# Altium project bmplc.prjpcb
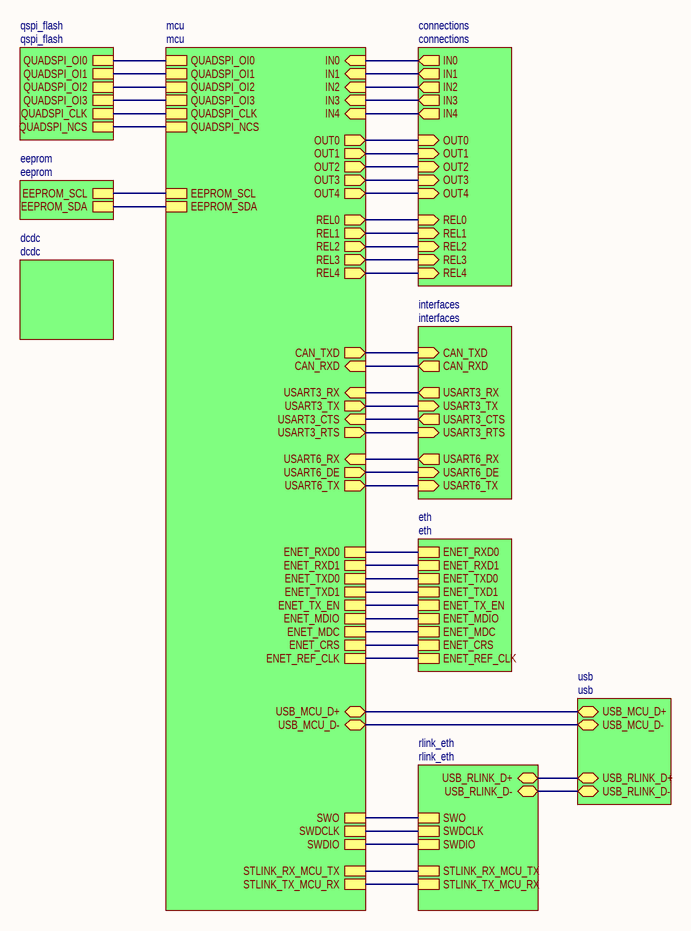
[diagram p0: main.SchDoc]
10 sheets, 194 parts. Net scope: hierarchical (ports join the sheet entries above them; power ports are global).
Board file: pcb.pcbdoc
Sheets:
  main.SchDoc
    mcu = mcu.SchDoc
    connections = connections.schdoc
    interfaces = interfaces.schdoc
    dcdc = dcdc.schdoc
    qspi_flash = qspi_flash.schdoc
    eeprom = eeprom.SchDoc
    eth = eth.SchDoc
    usb = usb.SchDoc
    rlink_eth = rlink_eth.schdoc

## Sheet main.SchDoc
size 209 x 297 mm

### Sub-sheets
connections = connections: IN0 (out), IN1 (out), IN2 (out), IN3 (out), IN4 (out), OUT0 (in), OUT1 (in), OUT2 (in), OUT3 (in), OUT4 (in), REL0 (in), REL1 (in), REL2 (in), REL3 (in), REL4 (in)
dcdc = dcdc: no entries
eeprom = eeprom: EEPROM_SCL, EEPROM_SDA
eth = eth: ENET_RXD0, ENET_RXD1, ENET_TXD0, ENET_TXD1, ENET_TX_EN, ENET_MDIO, ENET_MDC, ENET_CRS, ENET_REF_CLK
interfaces = interfaces: CAN_TXD (in), CAN_RXD (out), USART3_RX (out), USART3_TX (in), USART3_CTS (out), USART3_RTS (in), USART6_RX (out), USART6_DE (in), USART6_TX (in)
mcu = mcu: IN0 (in), IN1 (in), IN2 (in), IN3 (in), IN4 (in), OUT0 (out), OUT1 (out), OUT2 (out), OUT3 (out), OUT4 (out), REL0 (out), REL1 (out), REL2 (out), REL3 (out), REL4 (out), CAN_TXD (out), CAN_RXD (in), USART3_RX (in), USART3_TX (out), USART3_CTS (in), USART3_RTS (out), USART6_RX (in), USART6_DE (out), USART6_TX (out), QUADSPI_OI0, QUADSPI_OI1, QUADSPI_OI2, QUADSPI_OI3, QUADSPI_CLK, QUADSPI_NCS, EEPROM_SCL, EEPROM_SDA, ENET_RXD0, ENET_RXD1, ENET_TXD0, ENET_TXD1, ENET_TX_EN, ENET_MDIO, ENET_MDC, ENET_CRS, USB_MCU_D+ (bidir), ENET_REF_CLK, SWO, SWDCLK, SWDIO, STLINK_RX_MCU_TX, STLINK_TX_MCU_RX, USB_MCU_D- (bidir)
qspi_flash = qspi_flash: QUADSPI_OI0, QUADSPI_OI1, QUADSPI_OI2, QUADSPI_OI3, QUADSPI_CLK, QUADSPI_NCS
rlink_eth = rlink_eth: USB_RLINK_D+ (bidir), USB_RLINK_D- (bidir), SWO, SWDCLK, SWDIO, STLINK_RX_MCU_TX, STLINK_TX_MCU_RX
usb = usb: USB_MCU_D+ (bidir), USB_MCU_D- (bidir), USB_RLINK_D+ (bidir), USB_RLINK_D- (bidir)

### Nets
ENET_CRS: sheet mcu/ENET_CRS, sheet eth/ENET_CRS
ENET_MDC: sheet mcu/ENET_MDC, sheet eth/ENET_MDC
ENET_MDIO: sheet mcu/ENET_MDIO, sheet eth/ENET_MDIO
ENET_REF_CLK: sheet mcu/ENET_REF_CLK, sheet eth/ENET_REF_CLK
ENET_RXD0: sheet mcu/ENET_RXD0, sheet eth/ENET_RXD0
ENET_RXD1: sheet mcu/ENET_RXD1, sheet eth/ENET_RXD1
ENET_TX_EN: sheet mcu/ENET_TX_EN, sheet eth/ENET_TX_EN
ENET_TXD0: sheet mcu/ENET_TXD0, sheet eth/ENET_TXD0
ENET_TXD1: sheet mcu/ENET_TXD1, sheet eth/ENET_TXD1
QUADSPI_CLK: sheet mcu/QUADSPI_CLK, sheet qspi_flash/QUADSPI_CLK
QUADSPI_NCS: sheet mcu/QUADSPI_NCS, sheet qspi_flash/QUADSPI_NCS
QUADSPI_OI0: sheet mcu/QUADSPI_OI0, sheet qspi_flash/QUADSPI_OI0
QUADSPI_OI1: sheet mcu/QUADSPI_OI1, sheet qspi_flash/QUADSPI_OI1
QUADSPI_OI2: sheet mcu/QUADSPI_OI2, sheet qspi_flash/QUADSPI_OI2
QUADSPI_OI3: sheet mcu/QUADSPI_OI3, sheet qspi_flash/QUADSPI_OI3
SWCLK1: sheet mcu/SWDCLK, sheet rlink_eth/SWDCLK
SWDIO1: sheet mcu/SWDIO, sheet rlink_eth/SWDIO
SWO1: sheet mcu/SWO, sheet rlink_eth/SWO
USB_MCU_N: sheet mcu/USB_MCU_D-, sheet usb/USB_MCU_D-
USB_MCU_P: sheet mcu/USB_MCU_D+, sheet usb/USB_MCU_D+
USB_RLINK_N: sheet usb/USB_RLINK_D-, sheet rlink_eth/USB_RLINK_D-
USB_RLINK_P: sheet usb/USB_RLINK_D+, sheet rlink_eth/USB_RLINK_D+
NetR18_2: sheet mcu/REL0, sheet connections/REL0
NetR19_2: sheet mcu/REL1, sheet connections/REL1
NetR20_2: sheet mcu/OUT0, sheet connections/OUT0
NetR21_2: sheet mcu/REL2, sheet connections/REL2
NetR22_2: sheet mcu/OUT1, sheet connections/OUT1
NetR23_2: sheet mcu/REL3, sheet connections/REL3
NetR24_2: sheet mcu/OUT2, sheet connections/OUT2
NetR25_2: sheet mcu/OUT3, sheet connections/OUT3
NetR26_2: sheet mcu/REL4, sheet connections/REL4
NetR27_2: sheet mcu/OUT4, sheet connections/OUT4
NetR73_2: sheet mcu/STLINK_RX_MCU_TX, sheet rlink_eth/STLINK_RX_MCU_TX
NetR74_2: sheet mcu/STLINK_TX_MCU_RX, sheet rlink_eth/STLINK_TX_MCU_RX
NetR76_1: sheet mcu/EEPROM_SDA, sheet eeprom/EEPROM_SDA
NetR77_1: sheet mcu/EEPROM_SCL, sheet eeprom/EEPROM_SCL
NetU1_46: sheet mcu/IN3, sheet connections/IN3
NetU1_47: sheet mcu/IN2, sheet connections/IN2
NetU1_48: sheet mcu/IN1, sheet connections/IN1
NetU1_55: sheet mcu/IN0, sheet connections/IN0
NetU1_77: sheet mcu/USART3_TX, sheet interfaces/USART3_TX
NetU1_78: sheet mcu/USART3_RX, sheet interfaces/USART3_RX
NetU1_80: sheet mcu/USART3_CTS, sheet interfaces/USART3_CTS
NetU1_81: sheet mcu/USART3_RTS, sheet interfaces/USART3_RTS
NetU1_93: sheet mcu/USART6_DE, sheet interfaces/USART6_DE
NetU1_96: sheet mcu/USART6_TX, sheet interfaces/USART6_TX
NetU1_97: sheet mcu/USART6_RX, sheet interfaces/USART6_RX
NetU1_114: sheet mcu/CAN_RXD, sheet interfaces/CAN_RXD
NetU1_115: sheet mcu/CAN_TXD, sheet interfaces/CAN_TXD
NetU1_127: sheet mcu/IN4, sheet connections/IN4

## Sheet mcu.SchDoc
size 209 x 297 mm; Scale: 1:1; DocumentType: Ñõåìà ýëåêòðè÷åñêàÿ ïðèíöèïèàëüíàÿ; FirstReferrence: ÀÁÂÃ.123456.001; Title1str: {Наименование}; PageSetup: Record=PageOptions¦CenterHorizontal=False¦CenterVertical=False¦PrintScale=0.95¦XCorrection=0.00¦YCorrection=0.00¦PrintKind=1¦BorderSize=5000000¦LeftOffset=0¦BottomOffset=0¦Orientation=1¦PaperLength=1000¦PaperWidth=1000¦Scale=100¦PaperSource=15¦PrintQuality=600¦MediaType=1¦DitherType=10¦PaperKind=A4¦PrintScaleMode=1; DocumentType1str: {Документ}; DocumentType2str: {Документ}
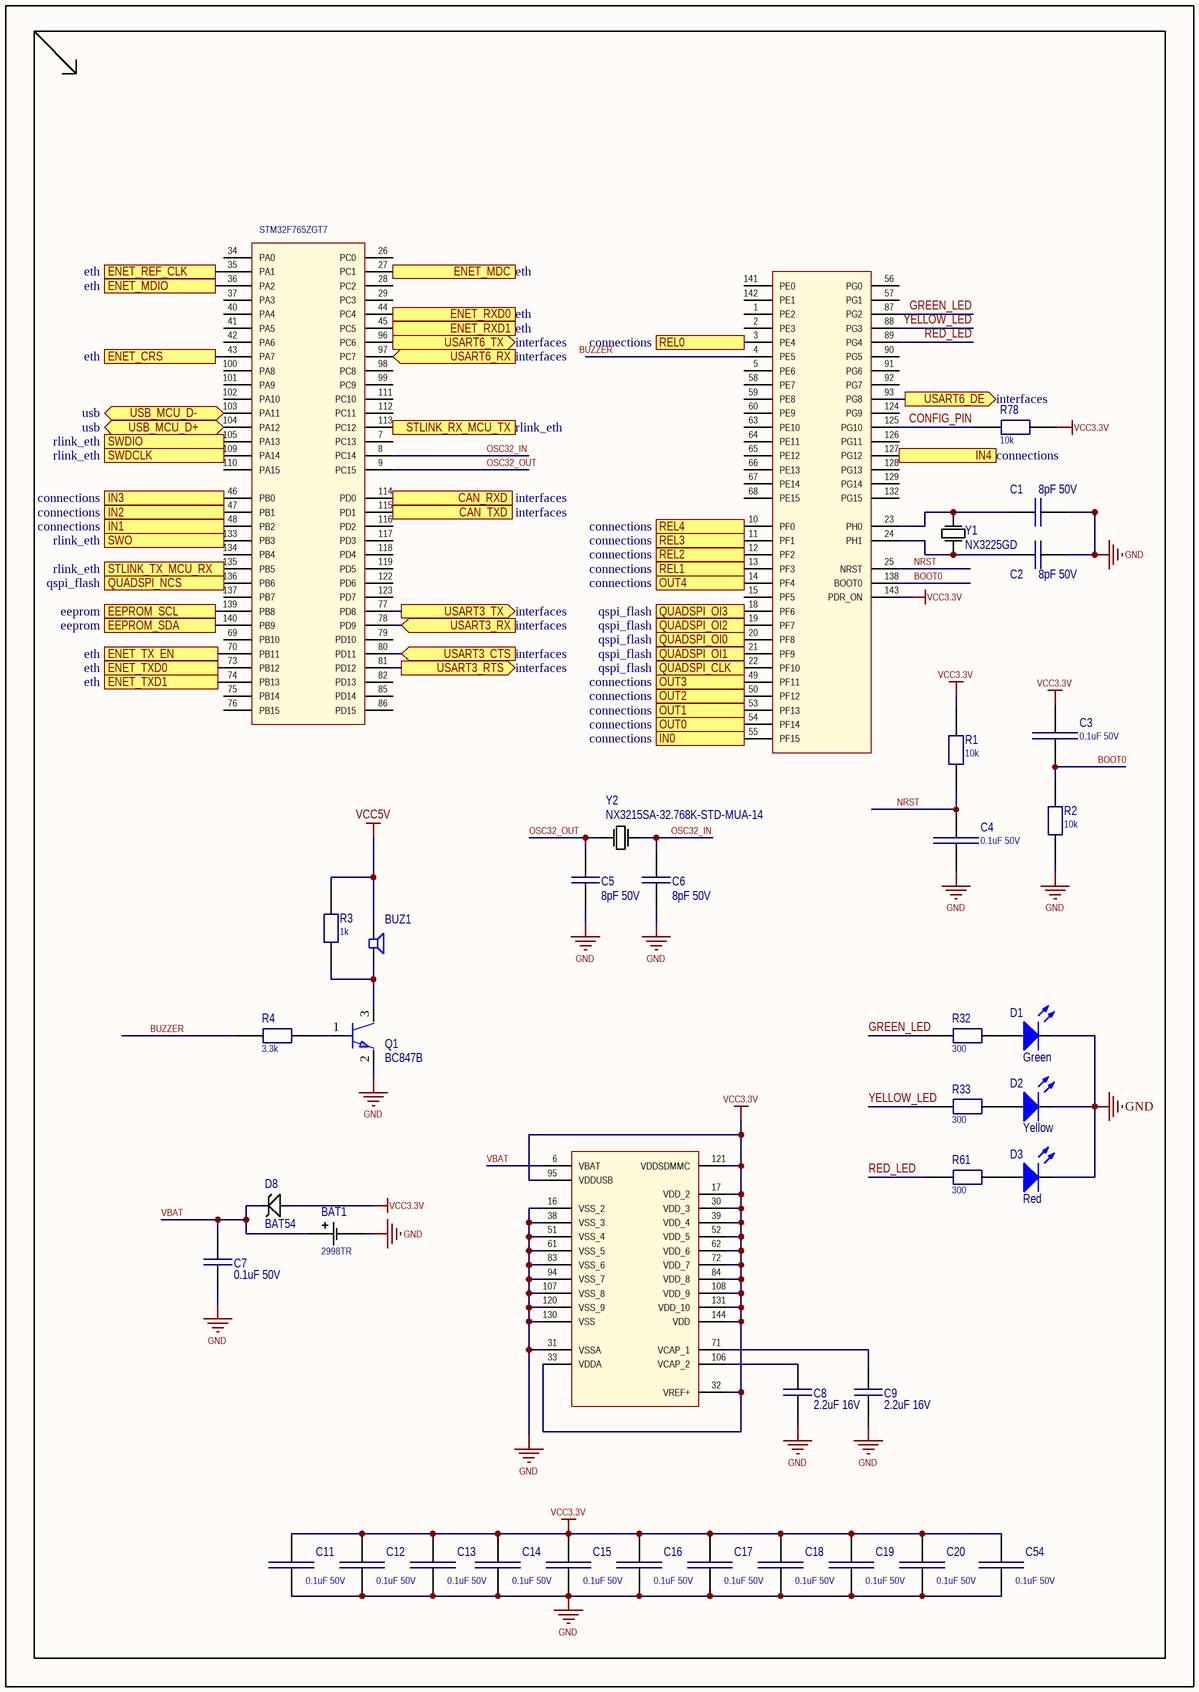
[diagram p1: mcu.SchDoc]

### Parts
BAT1  2998TR  [BAT_2998TR]
BUZ1  (no value)  [SPKR_PKMCS0909E4000-R1]
C1  8pF 50V  [C_0603]
C2  8pF 50V  [C_0603]
C3  0.1uF 50V  [C_0603]
C4  0.1uF 50V  [C_0603]
C5  8pF 50V  [C_0603]
C6  8pF 50V  [C_0603]
C7  0.1uF 50V  [C_0603]
C8  2.2uF 16V  [C_0603]
C9  2.2uF 16V  [C_0603]
C11  0.1uF 50V  [C_0603]
C12  0.1uF 50V  [C_0603]
C13  0.1uF 50V  [C_0603]
C14  0.1uF 50V  [C_0603]
C15  0.1uF 50V  [C_0603]
C16  0.1uF 50V  [C_0603]
C17  0.1uF 50V  [C_0603]
C18  0.1uF 50V  [C_0603]
C19  0.1uF 50V  [C_0603]
C20  0.1uF 50V  [C_0603]
C54  0.1uF 50V  [C_0603]
D1  Green  [LED_0603]
D2  Yellow  [LED_0603]
D3  Red  [LED_0603]
D8  BAT54  [SOT23]
Q1  BC847B  [SOT23]
R1  10k  [R_0603]
R2  10k  [R_0603]
R3  1k  [R_0603]
R4  3.3k  [R_0603]
R32  300  [R_0603]
R33  300  [R_0603]
R61  300  [R_0603]
R78  10k  [R_0603]
U1  STM32F765ZGT7  [TQFP144_M]  (parts A,B,C of 3)
Y1  NX3225GD  [NX3225GD]
Y2  NX3215SA-32.768K-STD-MUA-14  [XTAL_NX3215SA-32.768K-STD-MUA-8]

### Ports
CAN_RXD (in, see interfaces), CAN_TXD (out, see interfaces), EEPROM_SCL (see eeprom), EEPROM_SDA (see eeprom), ENET_CRS (see eth), ENET_MDC (see eth), ENET_MDIO (see eth), ENET_REF_CLK (see eth), ENET_RXD0 (see eth), ENET_RXD1 (see eth), ENET_TX_EN (see eth), ENET_TXD0 (see eth), ENET_TXD1 (see eth), IN0 (in, see connections), IN1 (in, see connections), IN2 (in, see connections), IN3 (in, see connections), IN4 (in, see connections), OUT0 (out, see connections), OUT1 (out, see connections), OUT2 (out, see connections), OUT3 (out, see connections), OUT4 (out, see connections), QUADSPI_CLK (see qspi_flash), QUADSPI_NCS (see qspi_flash), QUADSPI_OI0 (see qspi_flash), QUADSPI_OI1 (see qspi_flash), QUADSPI_OI2 (see qspi_flash), QUADSPI_OI3 (see qspi_flash), REL0 (out, see connections), REL1 (out, see connections), REL2 (out, see connections), REL3 (out, see connections), REL4 (out, see connections), STLINK_RX_MCU_TX (see rlink_eth), STLINK_TX_MCU_RX (see rlink_eth), SWDCLK (see rlink_eth), SWDIO (see rlink_eth), SWO (see rlink_eth), USART3_CTS (in, see interfaces), USART3_RTS (out, see interfaces), USART3_RX (in, see interfaces), USART3_TX (out, see interfaces), USART6_DE (out, see interfaces), USART6_RX (in, see interfaces), USART6_TX (out, see interfaces), USB_MCU_D+ (bidir, see usb), USB_MCU_D- (bidir, see usb)

### Nets
GND: BAT1.N(-) C1.1 C2.1 C4.1 C5.1 C6.1 C7.1 C8.1 C9.1 C11.1 C12.1 C13.1 C14.1 C15.1 C16.1 C17.1 C18.1 C19.1 C20.1 C54.1 D1.2(K) D2.2(K) D3.2(K) Q1.2 R2.1 U1.16(VSS_2) U1.31(VSSA) U1.38(VSS_3) U1.51(VSS_4) U1.61(VSS_5) U1.83(VSS_6) U1.94(VSS_7) U1.107(VSS_8) U1.120(VSS_9) U1.130(VSS)
VCC3.3V: C3.1 C11.2 C12.2 C13.2 C14.2 C15.2 C16.2 C17.2 C18.2 C19.2 C20.2 C54.2 D8.1 R1.2 R78.2 U1.17(VDD_2) U1.30(VDD_3) U1.32(VREF+) U1.33(VDDA) U1.39(VDD_4) U1.52(VDD_5) U1.62(VDD_6) U1.72(VDD_7) U1.84(VDD_8) U1.95(VDDUSB) U1.108(VDD_9) U1.121(VDDSDMMC) U1.131(VDD_10) U1.143(PDR_ON) U1.144(VDD)
VCC5V: BUZ1.1 R3.2
BOOT0: C3.2 R2.2 U1.138(BOOT0)
BUZZER: R4.1 U1.4(PE5)
CONFIG_PIN: R78.1 U1.125(PG10)
ENET_CRS: U1.43(PA7) ; port ENET_CRS
ENET_MDC: U1.27(PC1) ; port ENET_MDC
ENET_MDIO: U1.36(PA2) ; port ENET_MDIO
ENET_REF_CLK: U1.35(PA1) ; port ENET_REF_CLK
ENET_RXD0: U1.44(PC4) ; port ENET_RXD0
ENET_RXD1: U1.45(PC5) ; port ENET_RXD1
ENET_TX_EN: U1.70(PB11) ; port ENET_TX_EN
ENET_TXD0: U1.73(PB12) ; port ENET_TXD0
ENET_TXD1: U1.74(PB13) ; port ENET_TXD1
GREEN_LED: R32.2 U1.87(PG2)
NRST: C4.2 R1.1 U1.25(NRST)
OSC32_IN: C6.2 U1.8(PC14) Y2.2(OSC2)
OSC32_OUT: C5.2 U1.9(PC15) Y2.1(OSC1)
QUADSPI_CLK: U1.22(PF10) ; port QUADSPI_CLK
QUADSPI_NCS: U1.136(PB6) ; port QUADSPI_NCS
QUADSPI_OI0: U1.20(PF8) ; port QUADSPI_OI0
QUADSPI_OI1: U1.21(PF9) ; port QUADSPI_OI1
QUADSPI_OI2: U1.19(PF7) ; port QUADSPI_OI2
QUADSPI_OI3: U1.18(PF6) ; port QUADSPI_OI3
RED_LED: R61.2 U1.89(PG4)
SWCLK1: U1.109(PA14) ; port SWDCLK
SWDIO1: U1.105(PA13) ; port SWDIO
SWO1: U1.133(PB3) ; port SWO
USB_MCU_N: U1.103(PA11) ; port USB_MCU_D-
USB_MCU_P: U1.104(PA12) ; port USB_MCU_D+
VBAT: BAT1.P1(+) C7.2 D8.3 U1.6(VBAT)
YELLOW_LED: R33.2 U1.88(PG3)
NetBUZ1_2: BUZ1.2 Q1.3 R3.1
NetC1_2: C1.2 U1.23(PH0) Y1.2(OSC2)
NetC2_2: C2.2 U1.24(PH1) Y1.1(OSC1)
NetC8_2: C8.2 U1.106(VCAP_2)
NetC9_2: C9.2 U1.71(VCAP_1)
NetD1_1: D1.1(A) R32.1
NetD2_1: D2.1(A) R33.1
NetD3_1: D3.1(A) R61.1
NetQ1_1: Q1.1 R4.2
NetR18_2: U1.3(PE4) ; port REL0
NetR19_2: U1.13(PF3) ; port REL1
NetR20_2: U1.54(PF14) ; port OUT0
NetR21_2: U1.12(PF2) ; port REL2
NetR22_2: U1.53(PF13) ; port OUT1
NetR23_2: U1.11(PF1) ; port REL3
NetR24_2: U1.50(PF12) ; port OUT2
NetR25_2: U1.49(PF11) ; port OUT3
NetR26_2: U1.10(PF0) ; port REL4
NetR27_2: U1.14(PF4) ; port OUT4
NetR73_2: U1.113(PC12) ; port STLINK_RX_MCU_TX
NetR74_2: U1.135(PB5) ; port STLINK_TX_MCU_RX
NetR76_1: U1.140(PB9) ; port EEPROM_SDA
NetR77_1: U1.139(PB8) ; port EEPROM_SCL
NetU1_46: U1.46(PB0) ; port IN3
NetU1_47: U1.47(PB1) ; port IN2
NetU1_48: U1.48(PB2) ; port IN1
NetU1_55: U1.55(PF15) ; port IN0
NetU1_77: U1.77(PD8) ; port USART3_TX
NetU1_78: U1.78(PD9) ; port USART3_RX
NetU1_80: U1.80(PD11) ; port USART3_CTS
NetU1_81: U1.81(PD12) ; port USART3_RTS
NetU1_93: U1.93(PG8) ; port USART6_DE
NetU1_96: U1.96(PC6) ; port USART6_TX
NetU1_97: U1.97(PC7) ; port USART6_RX
NetU1_114: U1.114(PD0) ; port CAN_RXD
NetU1_115: U1.115(PD1) ; port CAN_TXD
NetU1_127: U1.127(PG12) ; port IN4

Not connected (* = marked no-connect by the designer): U1 1(PE2) 2(PE3) 5(PE6) 7(PC13) 15(PF5) 26(PC0) 28(PC2) 29(PC3) 34(PA0) 37(PA3) 40(PA4) 41(PA5) 42(PA6) 56(PG0) 57(PG1) 58(PE7) 59(PE8) 60(PE9) 63(PE10) 64(PE11) 65(PE12) 66(PE13) 67(PE14) 68(PE15) 69(PB10) 75(PB14) 76(PB15) 79(PD10) 82(PD13) 85(PD14) 86(PD15) 90(PG5) 91(PG6) 92(PG7) 98(PC8) 99(PC9) 100(PA8) 101(PA9) 102(PA10) 110(PA15) 111(PC10) 112(PC11) 116(PD2) 117(PD3) 118(PD4) 119(PD5) 122(PD6) 123(PD7) 124(PG9) 126(PG11) 128(PG13) 129(PG14) 132(PG15) 134(PB4) 137(PB7) 141(PE0) 142(PE1)

### Library data of the parts
BAT1 = 2998TR: Battery; Part: 2998TR; JLCPCB Part: C6078169
BUZ1 = BUZZER: Piezoelectric Sounders; Part: L-KLS3-SMT-09X1.8; Alternative Part: PKMCS0909E4000-R1; JLCPCB Part: C910763
C1 C2 C5 C6 = CAP_SMD: Capacitor; Part: CC0603DRNPO9BN8R0; Alternative Part: *; Value: 8pF 50V; JLCPCB Part: C326970
C3 C4 C11-C20 C54 = C0603: Capacitor; Part: CC0603KPX7R9BB104; Value: 0.1uF 50V; JLCPCB Part: C14663
C7 = CAP_SMD: Capacitor; Part: CC0603KPX7R9BB104; Alternative Part: *; Value: 0.1uF 50V; JLCPCB Part: C14663
C8 C9 = CAP_SMD: Capacitor; Part: CC0603KRX5R7BB225; Alternative Part: *; Value: 2.2uF 16V; JLCPCB Part: C106853
D1-D3 = LED_SMT_0603: LED; Part: FYLS-0603PGC; Alternative Part: KP-1608CGCK; Value: *
  D1: Color: Green; JLCPCB Part: C2994781
  D2: Color: Yellow; JLCPCB Part: C72038
  D3: Color: Red; JLCPCB Part: C2986060
D8 = BAT54: Diode; Part: BAT54; JLCPCB Part: C408389
Q1 = BC847B: Transistor; Part: BC847B; JLCPCB Part: C181140
R1 R2 R78 = RES_SMD: Resistor; Part: RC0603JR-0710KL; Alternative Part: *; Value: 10k; JLCPCB Part: C99198
R3 = RES_SMD: Resistor; Part: RC0603FR-071KL; Alternative Part: *; Value: 1k; JLCPCB Part: C22548
R4 = RES_SMD: Resistor; Part: RC0603FR-073K3L; Alternative Part: *; Value: 3.3k; JLCPCB Part: C108078
R32 R33 R61 = R0603: Resistor; Part: RC0603FR-07300RL; Value: 300; JLCPCB Part: C114617
U1 = STM32F76XZXT: Microcontroller; C: Copyright (C) 2016 Accelerated Designs. All rights reserved; Vendor: STMicroelectronics; Value: STM32F765ZGT7; Manufacturer_Part_Number: STM32F76XZXT; Copyright: Copyright (C) 2016 Accelerated Designs. All rights reserved; Part: STM32F765ZGT; JLCPCB Part: C1337348
Y1 = NX3225GD: Crystal Oscillator; Part: NX3225GD-8MHZ-STD-CRA-3; Alternative Part: *; JLCPCB Part: C889706
Y2 = NX3215SA-32.768K: Crystal Oscillator; Part: NX3215SA-32.768K-STD-MUA-14; Alternative Part: *; JLCPCB Part: C156244

## Sheet connections.schdoc
size 209 x 297 mm; Scale: 1:1; DocumentType: Схема электрическая принципиальная; FirstReferrence: АБВГ.123456.001; PageSetup: Record=PageOptions|CenterHorizontal=False|CenterVertical=False|PrintScale=0.95|XCorrection=0.00|YCorrection=0.00|PrintKind=1|BorderSize=5000000|LeftOffset=0|BottomOffset=0|Orientation=1|PaperLength=1000|PaperWidth=1000|Scale=100|PaperSource=15|PrintQuality=600|MediaType=1|DitherType=10|PaperKind=A4|PrintScaleMode=1
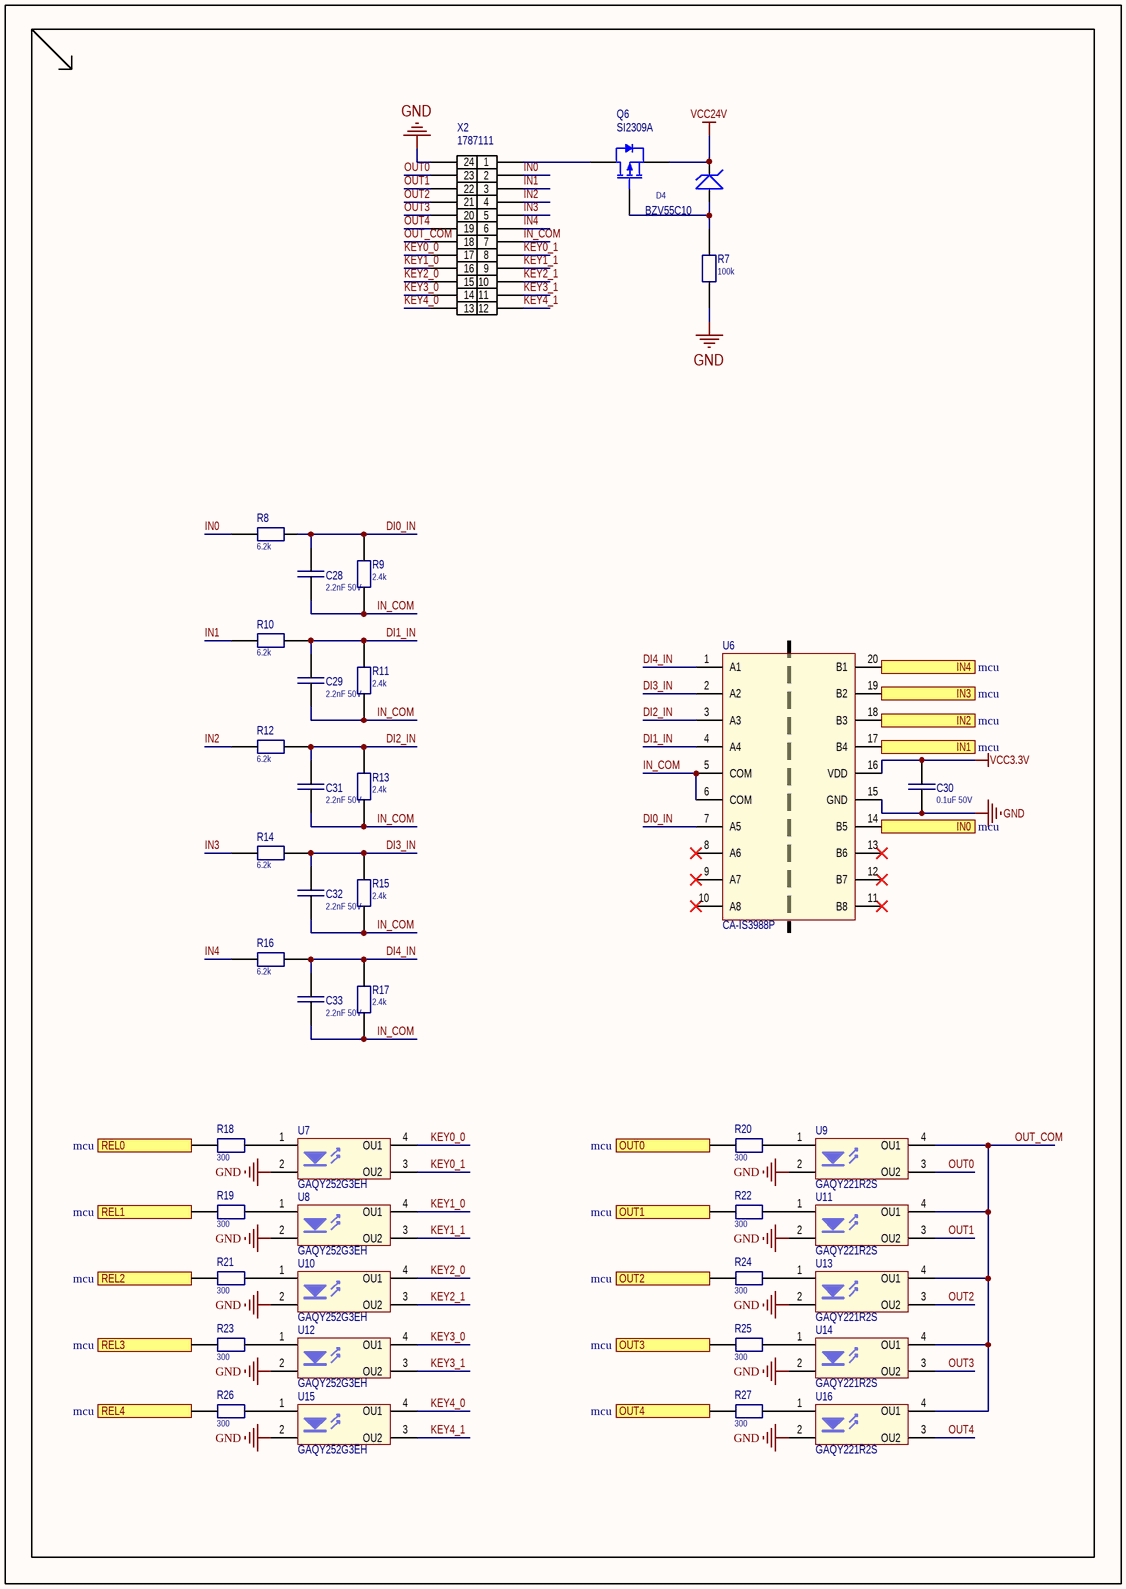
[diagram p2: connections.schdoc]

### Parts
C28  2.2nF 50V  [C_0805]
C29  2.2nF 50V  [C_0805]
C30  0.1uF 50V  [C_0603]
C31  2.2nF 50V  [C_0805]
C32  2.2nF 50V  [C_0805]
C33  2.2nF 50V  [C_0805]
D4  BZV55C10  [SOD80C]
Q6  SI2309A  [SOT23]
R7  100k  [R_0603]
R8  6.2k  [R_0805]
R9  2.4k  [R_0805]
R10  6.2k  [R_0805]
R11  2.4k  [R_0805]
R12  6.2k  [R_0805]
R13  2.4k  [R_0805]
R14  6.2k  [R_0805]
R15  2.4k  [R_0805]
R16  6.2k  [R_0805]
R17  2.4k  [R_0805]
R18  300  [R_0603]
R19  300  [R_0603]
R20  300  [R_0603]
R21  300  [R_0603]
R22  300  [R_0603]
R23  300  [R_0603]
R24  300  [R_0603]
R25  300  [R_0603]
R26  300  [R_0603]
R27  300  [R_0603]
U6  CA-IS3988P  [SOP64P600X175-20N]
U7  GAQY252G3EH  [SMD-4P]
U8  GAQY252G3EH  [SMD-4P]
U9  GAQY221R2S  [SOP254P700X270-4N]
U10  GAQY252G3EH  [SMD-4P]
U11  GAQY221R2S  [SOP254P700X270-4N]
U12  GAQY252G3EH  [SMD-4P]
U13  GAQY221R2S  [SOP254P700X270-4N]
U14  GAQY221R2S  [SOP254P700X270-4N]
U15  GAQY252G3EH  [SMD-4P]
U16  GAQY221R2S  [SOP254P700X270-4N]
X2  1787111  [DMC 1,5/12-G1F-3,5-LRP20THRR72]

### Ports
IN0 (out, see mcu), IN1 (out, see mcu), IN2 (out, see mcu), IN3 (out, see mcu), IN4 (out, see mcu), OUT0 (in, see mcu), OUT1 (in, see mcu), OUT2 (in, see mcu), OUT3 (in, see mcu), OUT4 (in, see mcu), REL0 (in, see mcu), REL1 (in, see mcu), REL2 (in, see mcu), REL3 (in, see mcu), REL4 (in, see mcu)

### Nets
GND: C30.1 R7.2 U6.15(GND) U7.2(K) U8.2(K) U9.2(K) U10.2(K) U11.2(K) U12.2(K) U13.2(K) U14.2(K) U15.2(K) U16.2(K) X2.24
VCC3.3V: C30.2 U6.16(VDD)
VCC24V: D4.2(K) Q6.2(S)
DI0_IN: C28.2 R8.2 R9.2 U6.7(A5)
DI1_IN: C29.2 R10.2 R11.2 U6.4(A4)
DI2_IN: C31.2 R12.2 R13.2 U6.3(A3)
DI3_IN: C32.2 R14.2 R15.2 U6.2(A2)
DI4_IN: C33.2 R16.2 R17.2 U6.1(A1)
IN0: R8.1 X2.2
IN1: R10.1 X2.3
IN2: R12.1 X2.4
IN3: R14.1 X2.5
IN4: R16.1 X2.6
IN_COM: C28.1 C29.1 C31.1 C32.1 C33.1 R9.1 R11.1 R13.1 R15.1 R17.1 U6.5(COM) U6.6(COM) X2.7
KEY0_0: U7.4(OU1) X2.17
KEY0_1: U7.3(OU2) X2.8
KEY1_0: U8.4(OU1) X2.16
KEY1_1: U8.3(OU2) X2.9
KEY2_0: U10.4(OU1) X2.15
KEY2_1: U10.3(OU2) X2.10
KEY3_0: U12.4(OU1) X2.14
KEY3_1: U12.3(OU2) X2.11
KEY4_0: U15.4(OU1) X2.13
KEY4_1: U15.3(OU2) X2.12
OUT0: U9.3(OU2) X2.23
OUT1: U11.3(OU2) X2.22
OUT2: U13.3(OU2) X2.21
OUT3: U14.3(OU2) X2.20
OUT4: U16.3(OU2) X2.19
OUT_COM: U9.4(OU1) U11.4(OU1) U13.4(OU1) U14.4(OU1) U16.4(OU1) X2.18
NetD4_1: D4.1(A) Q6.1(G) R7.1
NetQ6_3: Q6.3(D) X2.1
NetR18_1: R18.1 U7.1(A)
NetR18_2: R18.2 ; port REL0
NetR19_1: R19.1 U8.1(A)
NetR19_2: R19.2 ; port REL1
NetR20_1: R20.1 U9.1(A)
NetR20_2: R20.2 ; port OUT0
NetR21_1: R21.1 U10.1(A)
NetR21_2: R21.2 ; port REL2
NetR22_1: R22.1 U11.1(A)
NetR22_2: R22.2 ; port OUT1
NetR23_1: R23.1 U12.1(A)
NetR23_2: R23.2 ; port REL3
NetR24_1: R24.1 U13.1(A)
NetR24_2: R24.2 ; port OUT2
NetR25_1: R25.1 U14.1(A)
NetR25_2: R25.2 ; port OUT3
NetR26_1: R26.1 U15.1(A)
NetR26_2: R26.2 ; port REL4
NetR27_1: R27.1 U16.1(A)
NetR27_2: R27.2 ; port OUT4
NetU1_46: U6.19(B2) ; port IN3
NetU1_47: U6.18(B3) ; port IN2
NetU1_48: U6.17(B4) ; port IN1
NetU1_55: U6.14(B5) ; port IN0
NetU1_127: U6.20(B1) ; port IN4

Not connected (* = marked no-connect by the designer): U6 8(A6)* 9(A7)* 10(A8)* 11(B8)* 12(B7)* 13(B6)*

### Library data of the parts
C28 C29 C31-C33 = C0805: Capacitor; Part: CC0805KRX7R9BB222; Alternative Part: CL21B222KBANNNC; Value: 2.2nF 50V; JLCPCB Part: C107146
C30 = C0603: Capacitor; Part: CC0603KPX7R9BB104; Value: 0.1uF 50V; JLCPCB Part: C14663
D4 = DZ_SOD80: Diode; Part: BZV55C10; JLCPCB Part: C545361
Q6 = P-ch_SOT23: P-Channel MOSFET; Part: SI2309A; JLCPCB Part: C2681220
R7 = RES_SMD: Resistor; Part: RC0603JR-07100KL; Alternative Part: *; Value: 100k; JLCPCB Part: C100048
R8 R10 R12 R14 R16 = R0805: Resistor; Part: RC0805JR-076K2L; Alternative Part: CR-05JL7-6K2; Value: 6.2k; JLCPCB Part: C114535
R9 R11 R13 R15 R17 = R0805: Resistor; Part: RC0805JR-072K4L; Alternative Part: CR-05JL7-2K4; Value: 2.4k; JLCPCB Part: C114236
R18-R27 = R0603: Resistor; Part: RC0603FR-07300RL; Value: 300; JLCPCB Part: C114617
U6 = CA-IS3988P: Isolated Octal Industrial Digital Input; Part: CA-IS3988P; JLCPCB Part: C5210911
U7 U8 U10 U12 U15 = GAQY252G3EH: Solid State Relay 60V 3A; Part: GAQY252G3EH; JLCPCB Part: C7435131
U9 U11 U13 U14 U16 = KAQY212S: Solid State Relay 60V 250mA; Part: GAQY221R2S; JLCPCB Part: C22385176
X2 = DMC 1,5/12-G1F-3,5-LRP20THRR72 / 1706067: THR-3.5-24P; Part: 1787111; JLCPCB Part: 1787111

## Sheet interfaces.schdoc
size 209 x 297 mm; Scale: 1:1; DocumentType: Ñõåìà ýëåêòðè÷åñêàÿ ïðèíöèïèàëüíàÿ; FirstReferrence: ÀÁÂÃ.123456.001; PageSetup: Record=PageOptions¦CenterHorizontal=False¦CenterVertical=False¦PrintScale=0.95¦XCorrection=0.00¦YCorrection=0.00¦PrintKind=1¦BorderSize=5000000¦LeftOffset=0¦BottomOffset=0¦Orientation=1¦PaperLength=1000¦PaperWidth=1000¦Scale=100¦PaperSource=15¦PrintQuality=600¦MediaType=1¦DitherType=10¦PaperKind=A4¦PrintScaleMode=1
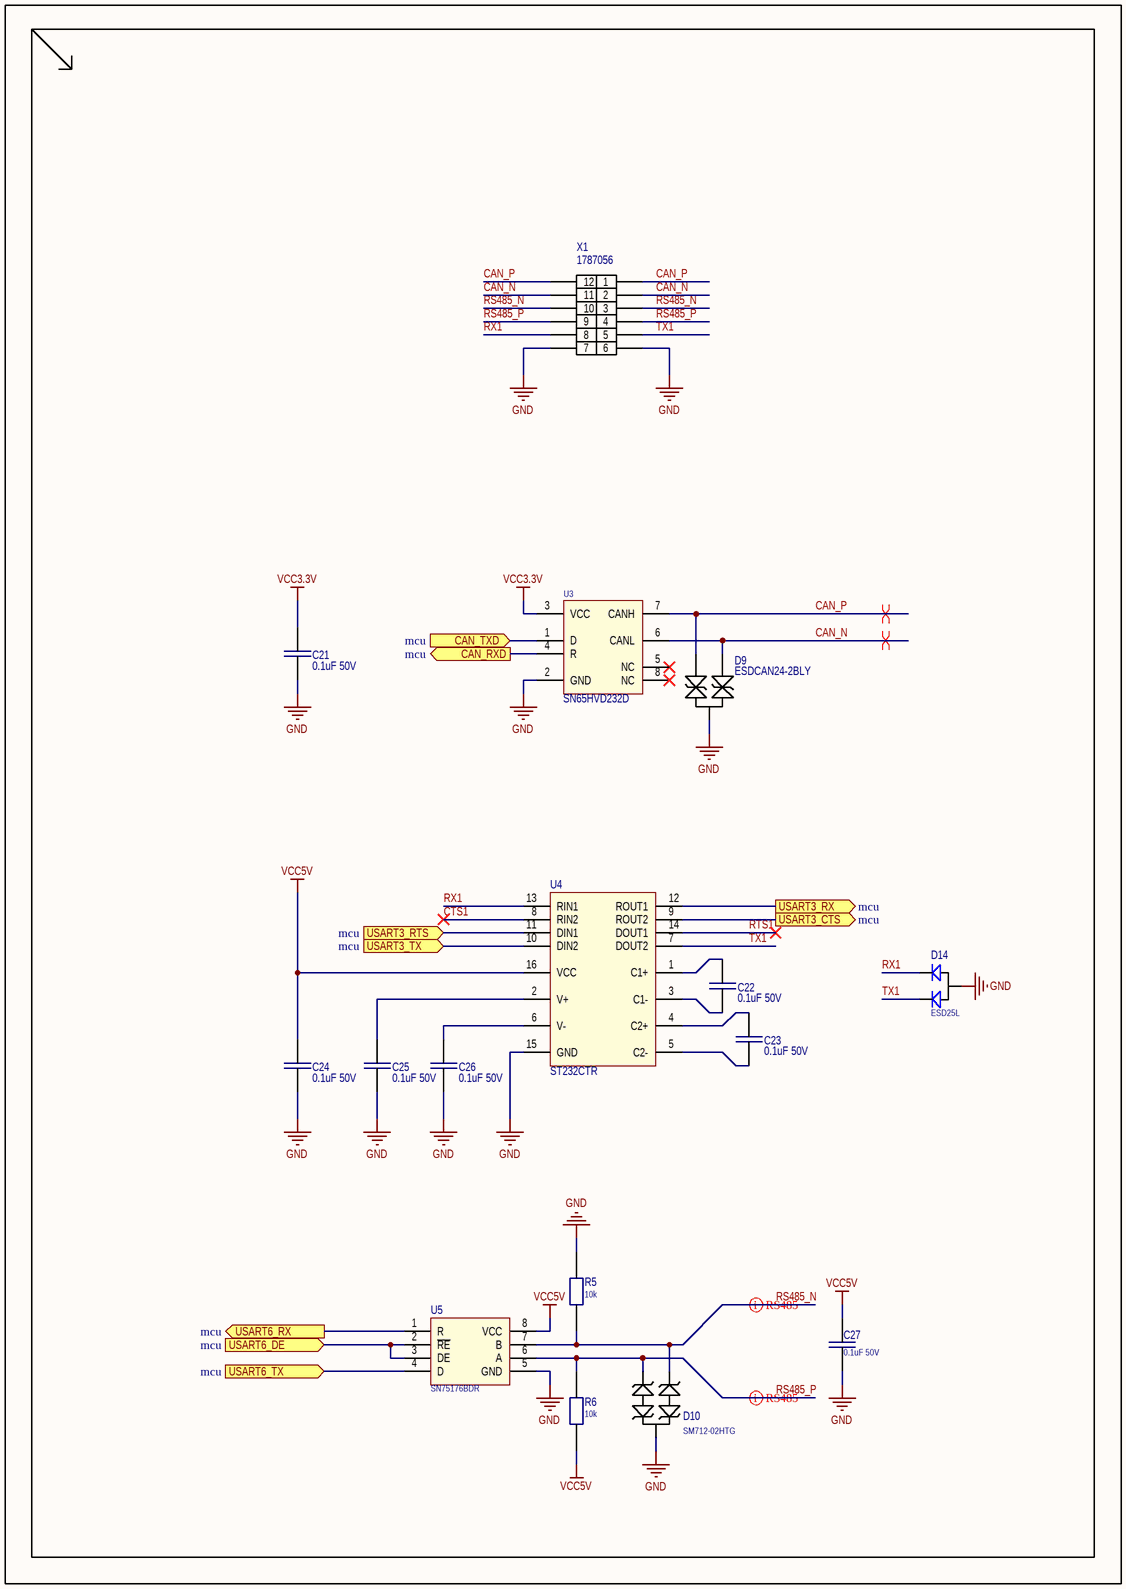
[diagram p3: interfaces.schdoc]

### Parts
C21  0.1uF 50V  [C_0603]
C22  0.1uF 50V  [C_0603]
C23  0.1uF 50V  [C_0603]
C24  0.1uF 50V  [C_0603]
C25  0.1uF 50V  [C_0603]
C26  0.1uF 50V  [C_0603]
C27  0.1uF 50V  [C_0603]
D9  ESDCAN24-2BLY  [SOT23]
D10  SM712-02HTG  [SOT23]
D14  ESD25L  [SOT23]
R5  10k  [R_0603]
R6  10k  [R_0603]
U3  SN65HVD232D  [SO-8_M]
U4  ST232CTR  [TSSOP16_STM]
U5  SN75176BDR  [SO-8]
X1  1787056  [DMC 1.5/ 6-G1F-3.5-LR P20THR 1787056]

### Ports
CAN_RXD (out, see mcu), CAN_TXD (in, see mcu), USART3_CTS (out, see mcu), USART3_RTS (in, see mcu), USART3_RX (out, see mcu), USART3_TX (in, see mcu), USART6_DE (in, see mcu), USART6_RX (out, see mcu), USART6_TX (in, see mcu)

### Nets
GND: C21.1 C24.1 C25.1 C26.1 C27.1 D9.3 D10.3 D14.3 R5.2 U3.2(GND) U4.15(GND) U5.5(GND) X1.6 X1.7
VCC3.3V: C21.2 U3.3(VCC)
VCC5V: C24.2 C27.2 R6.1 U4.16(VCC) U5.8(VCC)
CAN_N: D9.2 U3.6(CANL) X1.2 X1.11
CAN_P: D9.1 U3.7(CANH) X1.1 X1.12
CTS1: U4.8(RIN2)
RS485_N: D10.1 R5.1 U5.7(B) X1.3 X1.10
RS485_P: D10.2 R6.2 U5.6(A) X1.4 X1.9
RTS1: U4.14(DOUT1)
RX1: D14.2 U4.13(RIN1) X1.8
TX1: D14.1 U4.7(DOUT2) X1.5
NetC22_1: C22.1 U4.1(C1+)
NetC22_2: C22.2 U4.3(C1-)
NetC23_1: C23.1 U4.4(C2+)
NetC23_2: C23.2 U4.5(C2-)
NetC25_2: C25.2 U4.2(V+)
NetC26_2: C26.2 U4.6(V-)
NetU1_77: U4.10(DIN2) ; port USART3_TX
NetU1_78: U4.12(ROUT1) ; port USART3_RX
NetU1_80: U4.9(ROUT2) ; port USART3_CTS
NetU1_81: U4.11(DIN1) ; port USART3_RTS
NetU1_93: U5.2(~{RE}) U5.3(DE) ; port USART6_DE
NetU1_96: U5.4(D) ; port USART6_TX
NetU1_97: U5.1(R) ; port USART6_RX
NetU1_114: U3.4(R) ; port CAN_RXD
NetU1_115: U3.1(D) ; port CAN_TXD

Not connected (* = marked no-connect by the designer): U3 5(NC)* 8(NC)*

### Layout directives
differential pair; net class CAN: CAN_N, CAN_P
differential pair; net class RS485; differential pair class RS485: RS485_N, RS485_P

### Library data of the parts
C21 C27 = CAP_SMD: Capacitor; Part: CC0603KPX7R9BB104; Alternative Part: *; Value: 0.1uF 50V; JLCPCB Part: C14663
C22-C26 = C0603: Capacitor; Part: CC0603KPX7R9BB104; Value: 0.1uF 50V; JLCPCB Part: C14663
D9 = ESD_CAN: ESD; Value: ESDCAN24-2BLY; Part: ESDCAN24-2BLY; Alternative Part: *; JLCPCB Part: C5158050
D10 = ESD: Value: SM712-02HTG; Part: SM712-02HTG; Alternative Part: *; JLCPCB Part: C5449363
D14 = TVS_SOT23: Diode; Part: ESDA25L; JLCPCBPart: C95343; JLCPCB Part: C95343
R5 R6 = RES_SMD: Resistor; Part: RC0603JR-0710KL; Alternative Part: *; Value: 10k; JLCPCB Part: C99198
U3 = SN65HVD232D: CAN_transiever; Part: SN65HVD232DR; Alternative Part: *; JLCPCB Part: C30530
U4 = ST232CTR: Mfr_Name: STMicroelectronics; Copyright: Copyright (C) 2022 Ultra Librarian. All rights reserved.; Part: ST232CTR; RefDes: RefDes; Type: DEV; JLCPCB Part: C13482
U5 = SN75176BDR: RS485 Half Duplex Convertor; Part: SN75176BDR; JLCPCB Part: C2829048
X1 = 15EDGRHCM-THR-3.5: THR-3.5-12P; Part: 1787056; JLCPCB Part: C2923273

## Sheet dcdc.schdoc
size 209 x 297 mm; PageSetup: Record=PageOptions|CenterHorizontal=False|CenterVertical=False|PrintScale=0.95|XCorrection=0.00|YCorrection=0.00|PrintKind=1|BorderSize=5000000|LeftOffset=0|BottomOffset=0|Orientation=1|PaperLength=1000|PaperWidth=1000|Scale=100|PaperSource=15|PrintQuality=600|MediaType=1|DitherType=10|PaperKind=A4|PrintScaleMode=1
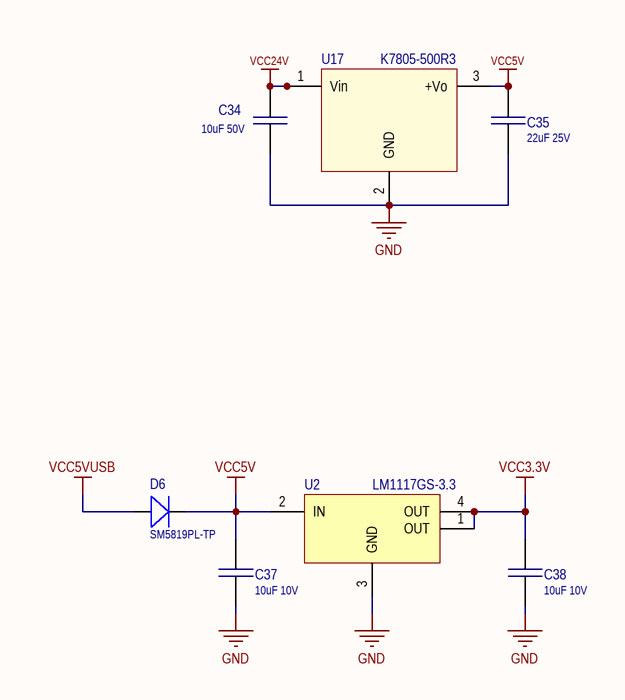
[diagram p4: dcdc.schdoc]

### Parts
C34  10uF 50V  [C_1206]
C35  22uF 25V  [C_1206]
C37  10uF 10V  [C_0805]
C38  10uF 10V  [C_0805]
D6  SM5819PL-TP  [SOD-123]
U2  LM1117GS-3.3  [SOT 223]
U17  K7805-500R3  [K7805500R3]

### Nets
GND: C34.2 C35.1 C37.1 C38.1 U2.3(GND) U17.2(GND)
VCC3.3V: C38.2 U2.1(OUT) U2.4(OUT)
VCC5V: C35.2 C37.2 D6.2(K) U2.2(IN) U17.3(+Vo)
VCC5VUSB: D6.1(A)
VCC24V: C34.1 U17.1(Vin)

### Library data of the parts
C34 = C1206: Capacitor; Part: CC1206KKX5R9BB106; Alternative Part: CL31A106KBHNNNE; Value: 10uF 50V; JLCPCB Part: C100122
C35 = C1206: Capacitor; Part: CC1206KKX5R8BB226; Alternative Part: CL31A226KAHNNNE; Value: 22uF 25V; JLCPCB Part: C2178233
C37 C38 = C0805: Capacitor; Part: CC0805KKX5R6BB106; Value: 10uF 10V; Parameter 2: *; JLCPCB Part: C89832
D6 = D_SOD123: Diode; Part: SM5819PL-TP; JLCPCB Part: C19992592
U2 = LDO 3.3v: Part: LM1117GS-3.3; JLCPCB Part: C411821
U17 = K78xx-500R3: Non-isolated dc-dc; Part: K7805-500R3; JLCPCB Part: C19188491

## Sheet qspi_flash.schdoc
size 209 x 297 mm; Scale: 1:1; DocumentType: Ñõåìà ýëåêòðè÷åñêàÿ ïðèíöèïèàëüíàÿ; FirstReferrence: ÀÁÂÃ.123456.001; Title1str: {Наименование}; PageSetup: Record=PageOptions¦CenterHorizontal=False¦CenterVertical=False¦PrintScale=0.95¦XCorrection=0.00¦YCorrection=0.00¦PrintKind=1¦BorderSize=5000000¦LeftOffset=0¦BottomOffset=0¦Orientation=1¦PaperLength=1000¦PaperWidth=1000¦Scale=100¦PaperSource=15¦PrintQuality=600¦MediaType=1¦DitherType=10¦PaperKind=A4¦PrintScaleMode=1; DocumentType1str: {Документ}; DocumentType2str: {Документ}
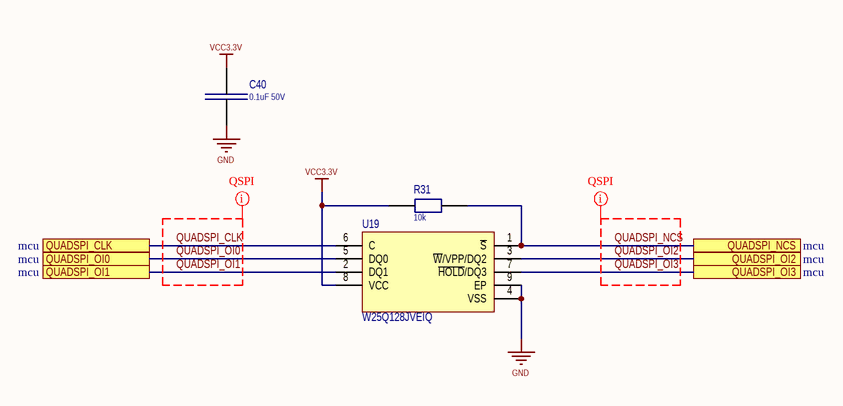
[diagram p5: qspi_flash.schdoc]

### Parts
C40  0.1uF 50V  [C_0603]
R31  10k  [R_0603]
U19  W25Q128JVEIQ  [W-PDFN-8 (MLP8) – 8mm ? 6mm  Se]

### Ports
QUADSPI_CLK (see mcu), QUADSPI_NCS (see mcu), QUADSPI_OI0 (see mcu), QUADSPI_OI1 (see mcu), QUADSPI_OI2 (see mcu), QUADSPI_OI3 (see mcu)

### Nets
GND: C40.1 U19.4(VSS) U19.9(EP)
VCC3.3V: C40.2 R31.1 U19.8(VCC)
QUADSPI_CLK: U19.6(C) ; port QUADSPI_CLK
QUADSPI_NCS: R31.2 U19.1(~{S}) ; port QUADSPI_NCS
QUADSPI_OI0: U19.5(DQ0) ; port QUADSPI_OI0
QUADSPI_OI1: U19.2(DQ1) ; port QUADSPI_OI1
QUADSPI_OI2: U19.3(~{W}/VPP/DQ2) ; port QUADSPI_OI2
QUADSPI_OI3: U19.7(~{HOLD}/DQ3) ; port QUADSPI_OI3

### Layout directives
net class QSPI: QUADSPI_CLK, QUADSPI_NCS, QUADSPI_OI0, QUADSPI_OI1, QUADSPI_OI2, QUADSPI_OI3

### Library data of the parts
C40 = C0603: Capacitor; Part: CC0603KPX7R9BB104; Value: 0.1uF 50V; JLCPCB Part: C14663
R31 = RES_SMD: Resistor; Part: RC0603JR-0710KL; Alternative Part: *; Value: 10k; JLCPCB Part: C99198
U19 = MT25QL********W9-0SIT: Flash Memory; Part: W25Q128JVEIQ; Alternative Part: *; JLCPCB Part: C2456297

## Sheet eeprom.SchDoc
size 209 x 297 mm
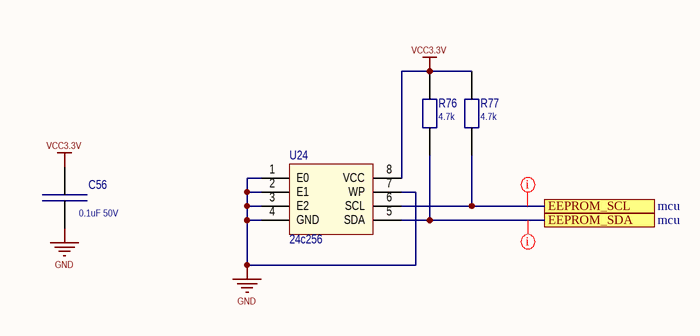
[diagram p6: eeprom.SchDoc]

### Parts
C56  0.1uF 50V  [C_0603]
R76  4.7k  [R_0603]
R77  4.7k  [R_0603]
U24  24c256  [SO-8_M]

### Ports
EEPROM_SCL (see mcu), EEPROM_SDA (see mcu)

### Nets
GND: C56.1 U24.1(E0) U24.2(E1) U24.3(E2) U24.4(GND) U24.7(WP)
VCC3.3V: C56.2 R76.2 R77.2 U24.8(VCC)
NetR76_1: R76.1 U24.5(SDA) ; port EEPROM_SDA
NetR77_1: R77.1 U24.6(SCL) ; port EEPROM_SCL

### Layout directives
net class I2C_EEPROM: NetR76_1, NetR77_1

### Library data of the parts
C56 = C0603: Capacitor; Part: CC0603KPX7R9BB104; Value: 0.1uF 50V; JLCPCB Part: C14663
R76 R77 = RES_SMD: Resistor; Part: RC0603FR-074K7L; Alternative Part: *; Value: 4.7k; JLCPCB Part: C99782
U24 = 24c256: 256-Kbit I2C-compatible Serial EEPROM; Part: AT24C256C; JLCPCB Part: C6482

## Sheet eth.SchDoc
size A4
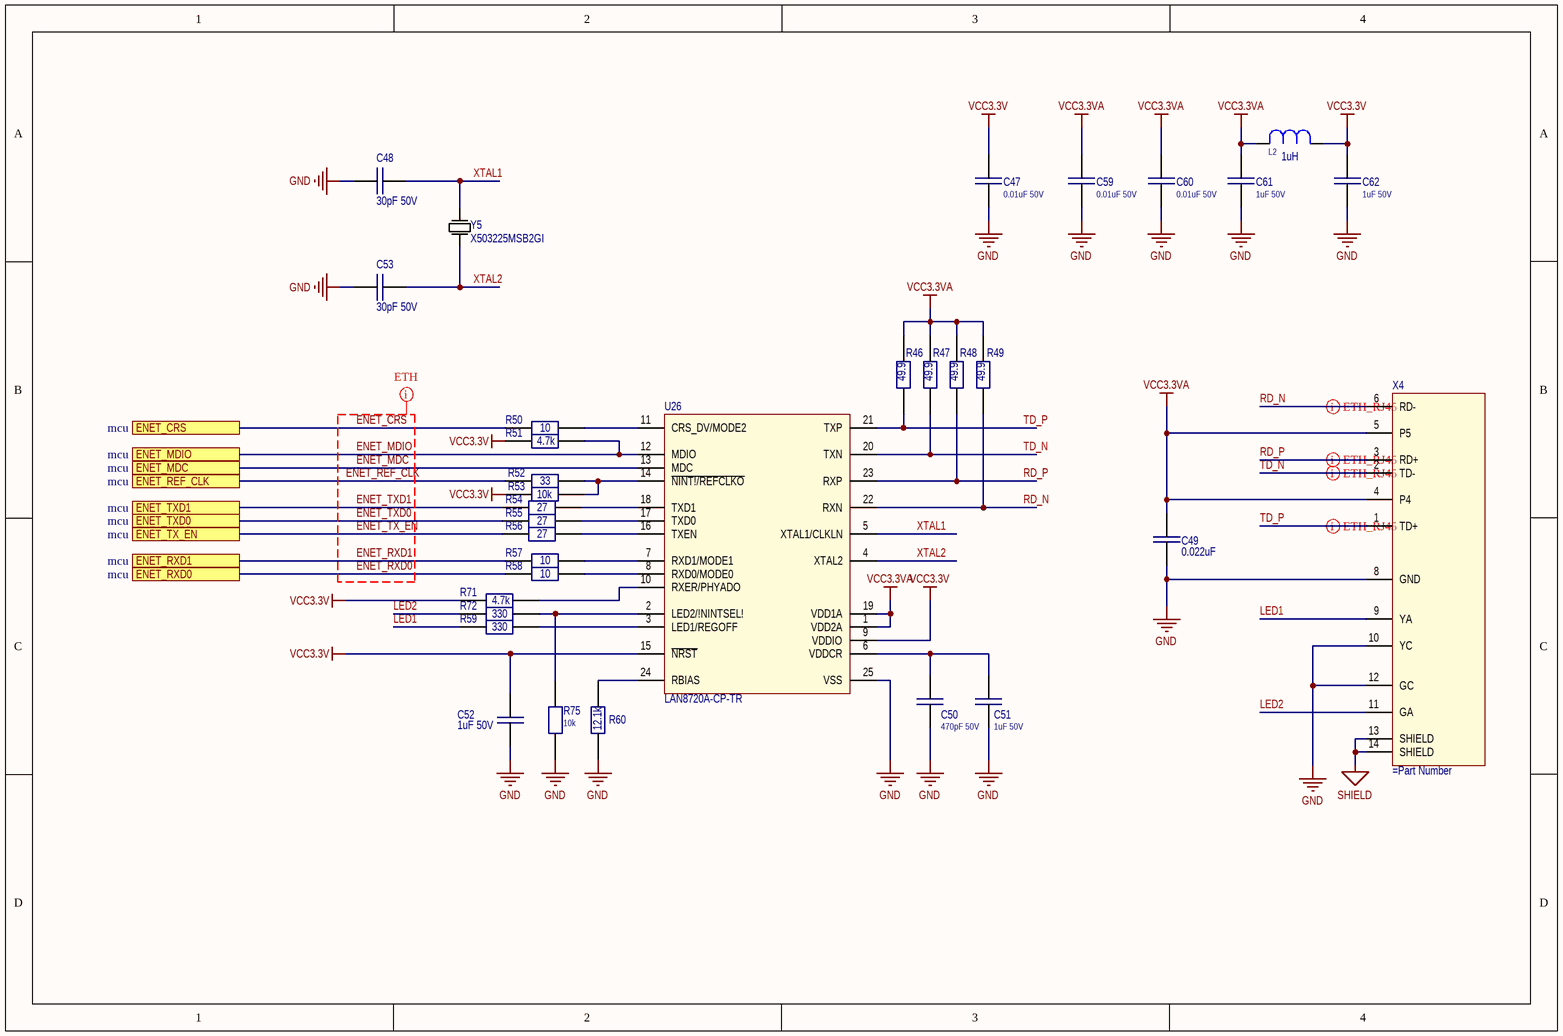
[diagram p7: eth.SchDoc]

### Parts
C47  0.01uF 50V  [C_0402]
C48  30pF 50V  [C_0603]
C49  0.022uF  [C_0603]
C50  470pF 50V  [C_0402]
C51  1uF 50V  [C_0603]
C52  1uF 50V  [C_0603]
C53  30pF 50V  [C_0603]
C59  0.01uF 50V  [C_0402]
C60  0.01uF 50V  [C_0402]
C61  1uF 50V  [C_0603]
C62  1uF 50V  [C_0603]
L2  1uH  [L_0603]
R46  49.9  [R_0603]
R47  49.9  [R_0603]
R48  49.9  [R_0603]
R49  49.9  [R_0603]
R50  10  [R_0603]
R51  4.7k  [R_0603]
R52  33  [R_0603]
R53  10k  [R_0603]
R54  27  [R_0603]
R55  27  [R_0603]
R56  27  [R_0603]
R57  10  [R_0603]
R58  10  [R_0603]
R59  330  [R_0603]
R60  12.1k  [R_0603]
R71  4.7k  [R_0603]
R72  330  [R_0603]
R75  10k  [R_0603]
U26  LAN8720A-CP-TR  [QFN50P400X400X100-25N]
X4  (no value)  [RJ45-TH_HR915340A]
Y5  X503225MSB2GI  [X5032]

### Ports
ENET_CRS (see mcu), ENET_MDC (see mcu), ENET_MDIO (see mcu), ENET_REF_CLK (see mcu), ENET_RXD0 (see mcu), ENET_RXD1 (see mcu), ENET_TX_EN (see mcu), ENET_TXD0 (see mcu), ENET_TXD1 (see mcu)

### Nets
GND: C47.2 C48.2 C49.1 C50.2 C51.1 C52.1 C53.2 C59.2 C60.2 C61.1 C62.1 R60.1 R75.1 U26.25(VSS) X4.8(GND) X4.10(YC) X4.12(GC)
SHIELD: X4.13(SHIELD) X4.14(SHIELD)
VCC3.3V: C47.1 C52.2 C62.2 L2.2 R51.1 R53.2 R71.1 U26.9(VDDIO) U26.15(~{NRST})
VCC3.3VA: C49.2 C59.1 C60.1 C61.2 L2.1 R46.2 R47.2 R48.2 R49.2 U26.1(VDD2A) U26.19(VDD1A) X4.4(P4) X4.5(P5)
ENET_CRS: R50.1 ; port ENET_CRS
ENET_MDC: U26.13(MDC) ; port ENET_MDC
ENET_MDIO: R51.2 U26.12(MDIO) ; port ENET_MDIO
ENET_REF_CLK: R52.1 ; port ENET_REF_CLK
ENET_RXD0: R58.1 ; port ENET_RXD0
ENET_RXD1: R57.1 ; port ENET_RXD1
ENET_TX_EN: R56.1 ; port ENET_TX_EN
ENET_TXD0: R55.1 ; port ENET_TXD0
ENET_TXD1: R54.1 ; port ENET_TXD1
LED1: R59.2 X4.9(YA)
LED2: R72.2 X4.11(GA)
RD_N: R49.1 U26.22(RXN) X4.6(RD-)
RD_P: R48.1 U26.23(RXP) X4.3(RD+)
TD_N: R47.1 U26.20(TXN) X4.2(TD-)
TD_P: R46.1 U26.21(TXP) X4.1(TD+)
XTAL1: C48.1 U26.5(XTAL1/CLKLN) Y5.1
XTAL2: C53.1 U26.4(XTAL2) Y5.2
NetC50_1: C50.1 C51.2 U26.6(VDDCR)
NetR50_2: R50.2 U26.11(CRS_DV/MODE2)
NetR52_2: R52.2 R53.1 U26.14(~{NINT!/REFCLKO})
NetR54_2: R54.2 U26.18(TXD1)
NetR55_2: R55.2 U26.17(TXD0)
NetR56_2: R56.2 U26.16(TXEN)
NetR57_2: R57.2 U26.7(RXD1/MODE1)
NetR58_2: R58.2 U26.8(RXD0/MODE0)
NetR59_1: R59.1 U26.3(LED1/REGOFF)
NetR60_2: R60.2 U26.24(RBIAS)
NetR71_2: R71.2 U26.10(RXER/PHYADO)
NetR72_1: R72.1 R75.2 U26.2(LED2/!NINTSEL!)

### Layout directives
differential pair; net class ETH_RJ45; differential pair class RJ45: RD_N, RD_P, TD_N, TD_P
net class ETH: ENET_CRS, ENET_MDC, ENET_MDIO, ENET_REF_CLK, ENET_RXD0, ENET_RXD1, ENET_TX_EN, ENET_TXD0, ENET_TXD1

### Library data of the parts
C47 C59 C60 = C0402: Capacitor; Part: CC0402KRX7R9BB103; Alternative Part: *; JLCPCB Part: C60133
C48 C53 = CAP_SMD: Capacitor; Part: CC0603JRNPO9BN300; Alternative Part: *; Value: 30pF 50V; JLCPCB Part: C113797
C49 = CAP_SMD: Capacitor; Part: CC0603KRX7R9BB223; Alternative Part: *; Value: 0.022uF; JLCPCB Part: C106222
C50 = C0402: Capacitor; Part: CC0402KRX7R9BB471; Alternative Part: *; JLCPCB Part: C106207
C51 C52 = CAP_SMD: Capacitor; Part: CC0603KRX7R9BB105; Alternative Part: *; Value: 1uF 50V; JLCPCB Part: C559769
C61 C62 = C0603: Capacitor; Part: CC0603KRX7R9BB105; Value: 1uF 50V; JLCPCB Part: C559769
L2 = L_0603: Inductor; Part: LQM18FN1R0M00D; Value: 1uH; JLCPCB Part: C113093
R46-R49 = RES_SMD: Resistor; Part: RC0603FR-0749R9L; Alternative Part: *; Value: 49.9; JLCPCB Part: C114625
R50 R57 R58 = RES_SMD: Resistor; Part: RC0603FR-0710RL; Alternative Part: *; Value: 10; JLCPCB Part: C109318
R51 R71 = RES_SMD: Resistor; Part: RC0603FR-074K7L; Alternative Part: *; Value: 4.7k; JLCPCB Part: C99782
R52 = RES_SMD: Resistor; Part: RC0603FR-0733RL; Alternative Part: *; Value: 33; JLCPCB Part: C108661
R53 R75 = RES_SMD: Resistor; Part: RC0603JR-0710KL; Alternative Part: *; Value: 10k; JLCPCB Part: C99198
R54-R56 = RES_SMD: Resistor; Part: RC0402JR-0727RL; Value: 27; JLCPCB Part: C137639
R59 R72 = RES_SMD: Resistor; Part: RC0603FR-07330RL; Alternative Part: *; Value: 330; JLCPCB Part: C105881
R60 = RES_SMD: Resistor; Part: RC0603FR-0712K1L; Alternative Part: *; Value: 12.1k; JLCPCB Part: C123417
U26 = LAN8720: Phy Eth 2/2 Transceiver Full RMII 24-QFN-EP _4x4_; MF: Microchip; Package: QFN-24 Microchip; Value: *; Price: None; MP: LAN8720A-CP; SnapEDA_Link: https://www.snapeda.com/parts/LAN8720A-CP/Microchip/view-part/237160/?ref=snap; Availability: Unavailable; Part: LAN8720A-CP-TR; Alternative Part: *; JLCPCB Part: C45223
X4 = HR915340A: DIP RJ45 Connector;; Package: None; MP: HR915340A; Value: *; Price: None; Availability: Unavailable; Part: HR915340A; Alternative Part: *; JLCPCB Part: C2760325
Y5 = X503212MSB2GI: Crystal Oscillator; Manufacturer_Name: Yangxing Tech; Geometry.Height: 1.35mm; Manufacturer_Part_Number: X503225MSB2GI; Part: X503225MSB2GI; Mouser Price/Stock: *; Alternative Part: *; Arrow Price/Stock: *; Datasheet Link: https://datasheet.lcsc.com/szlcsc/Yangxing-Tech-X503212MSB2GI_C112573.pdf; JLCPCB Part: C112569

## Sheet usb.SchDoc: {Наименование}
size 209 x 297 mm; DocumentNumber: {Обозначение}; SheetNumber: {}; SheetTotal: {}; PageSetup: Record=PageOptions|CenterHorizontal=False|CenterVertical=False|PrintScale=0.95|XCorrection=0.00|YCorrection=0.00|PrintKind=1|BorderSize=5000000|LeftOffset=0|BottomOffset=0|Orientation=1|PaperLength=1000|PaperWidth=1000|Scale=100|PaperSource=15|PrintQuality=600|MediaType=1|DitherType=10|PaperKind=A4|PrintScaleMode=1; Rule: PcbType=ProtelPcb
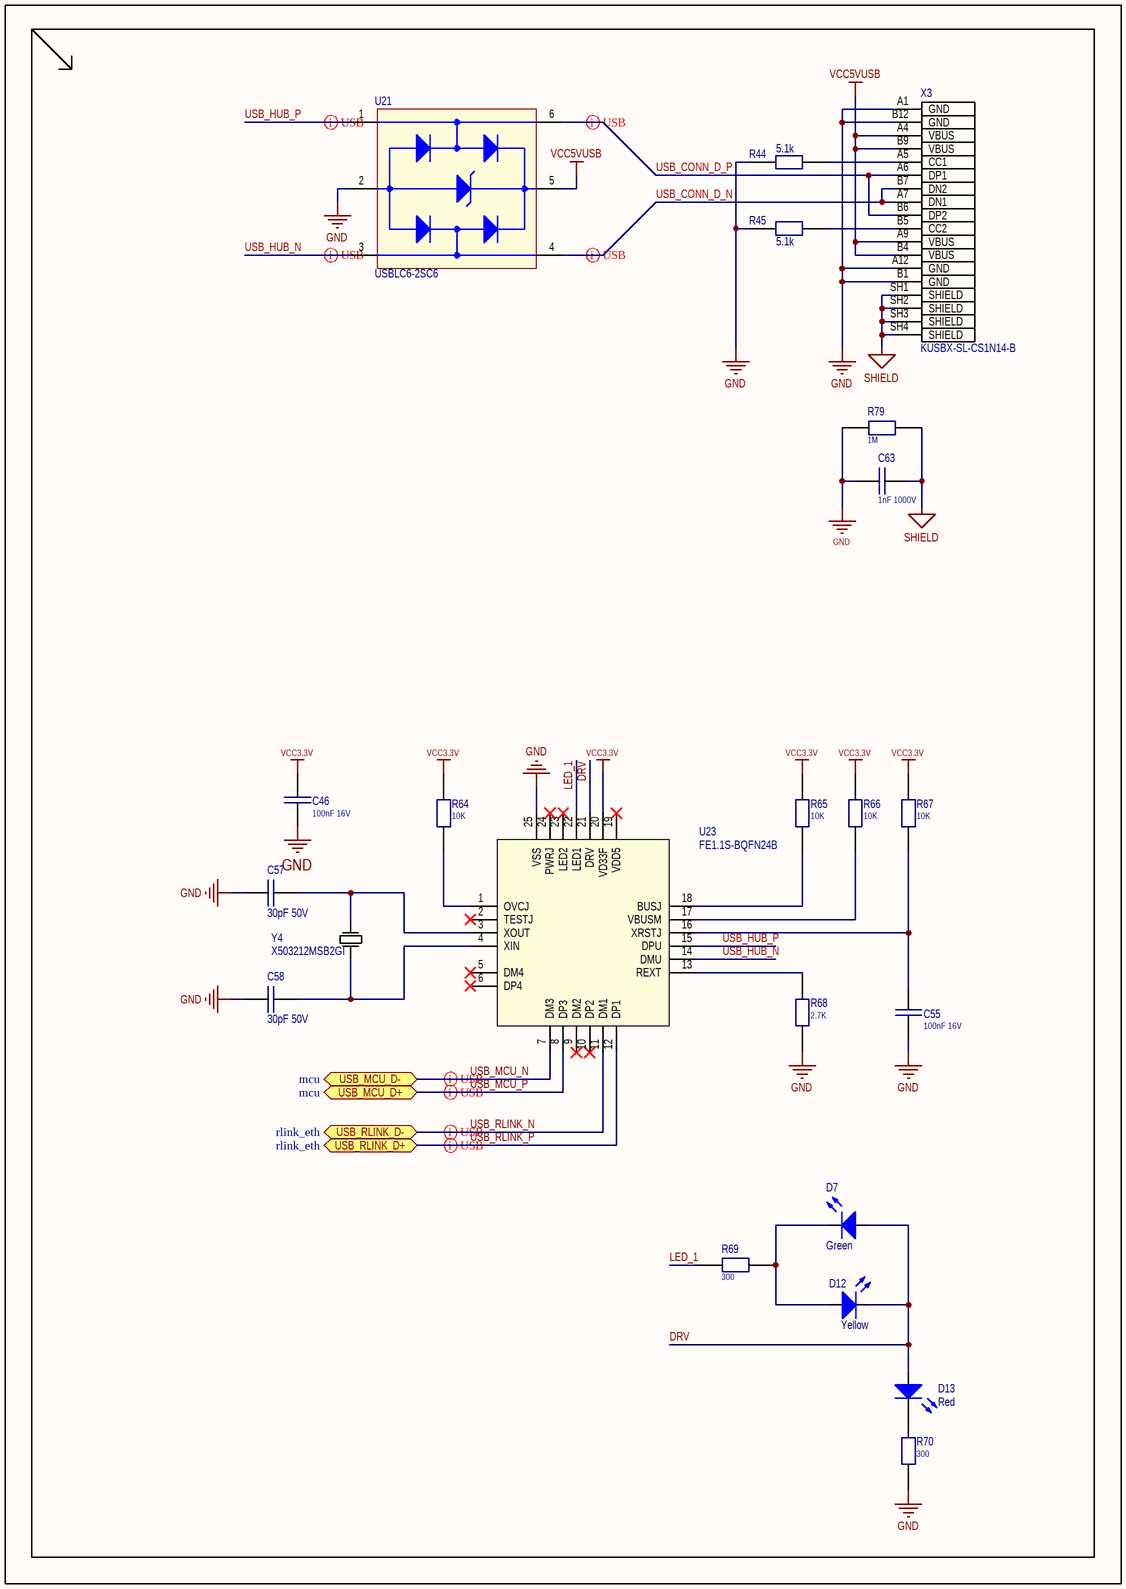
[diagram p8: usb.SchDoc]

### Parts
C46  100nF 16V  [C_0402]
C55  100nF 16V  [C_0402]
C57  30pF 50V  [C_0603]
C58  30pF 50V  [C_0603]
C63  1nF 1000V  [C_1206]
D7  Green  [LED_0603]
D12  Yellow  [LED_0603]
D13  Red  [LED_0603]
R44  5.1k  [R_0603]
R45  5.1k  [R_0603]
R64  10K  [R_0402]
R65  10K  [R_0402]
R66  10K  [R_0402]
R67  10K  [R_0402]
R68  2.7K  [R_0402]
R69  300  [R_0603]
R70  300  [R_0603]
R79  1M  [R_1206]
U21  USBLC6-2SC6  [SOT95P280X145-6N]
U23  FE1.1S-BQFN24B  [QFN50P400X400X80-25N-D]
X3  KUSBX-SL-CS1N14-B  [MOLEX_2169890001]
Y4  X503212MSB2GI  [X5032]

### Ports
USB_MCU_D+ (bidir, see mcu), USB_MCU_D- (bidir, see mcu), USB_RLINK_D+ (bidir, see rlink_eth), USB_RLINK_D- (bidir, see rlink_eth)

### Nets
GND: C46.1 C55.2 C57.2 C58.2 C63.1 R44.1 R45.1 R68.2 R70.1 R79.1 U21.2(GND) U23.25(VSS) X3.A1(GND) X3.A12(GND) X3.B1(GND) X3.B12(GND)
SHIELD: C63.2 R79.2 X3.SH1(SHIELD) X3.SH2(SHIELD) X3.SH3(SHIELD) X3.SH4(SHIELD)
VCC3.3V: C46.2 R64.2 R65.2 R66.2 R67.2 U23.20(VD33F)
VCC5VUSB: U21.5(VBUS) X3.A4(VBUS) X3.A9(VBUS) X3.B4(VBUS) X3.B9(VBUS)
DRV: D7.1(A) D12.2(K) D13.1(A) U23.21(DRV)
LED_1: R69.2 U23.22(LED1)
USB_CONN_D_N: U21.4(I/O2_OUT) X3.A7(DN1) X3.B7(DN2)
USB_CONN_D_P: U21.6(I/O1_OUT) X3.A6(DP1) X3.B6(DP2)
USB_HUB_N: U21.3(I/O2_IN) U23.14(DMU)
USB_HUB_P: U21.1(I/O1_IN) U23.15(DPU)
USB_MCU_N: U23.7(DM3) ; port USB_MCU_D-
USB_MCU_P: U23.8(DP3) ; port USB_MCU_D+
USB_RLINK_N: U23.11(DM1) ; port USB_RLINK_D-
USB_RLINK_P: U23.12(DP1) ; port USB_RLINK_D+
NetC55_1: C55.1 R67.1 U23.16(XRSTJ)
NetC57_1: C57.1 U23.3(XOUT) Y4.1
NetC58_1: C58.1 U23.4(XIN) Y4.2
NetD7_2: D7.2(K) D12.1(A) R69.1
NetD13_2: D13.2(K) R70.2
NetR44_2: R44.2 X3.A5(CC1)
NetR45_2: R45.2 X3.B5(CC2)
NetR64_1: R64.1 U23.1(OVCJ)
NetR65_1: R65.1 U23.18(BUSJ)
NetR66_1: R66.1 U23.17(VBUSM)
NetR68_1: R68.1 U23.13(REXT)

Not connected (* = marked no-connect by the designer): U23 2(TESTJ)* 5(DM4)* 6(DP4)* 9(DM2)* 10(DP2)* 19(VDD5)* 23(LED2)* 24(PWRJ)*

### Layout directives
differential pair; net class USB_HUB; differential pair class USB: USB_HUB_N, USB_HUB_P
differential pair; net class USB_C; differential pair class USB: USB_CONN_D_N, USB_CONN_D_P
differential pair; net class USB_MCU; differential pair class USB: USB_MCU_N, USB_MCU_P
differential pair; net class USB_RLINK; differential pair class USB: USB_RLINK_N, USB_RLINK_P

### Library data of the parts
C46 C55 = C0402: Capacitor; Part: CC0402KRX7R7BB104; Alternative Part: CC0402KRX5R7BB104; JLCPCB Part: C60474
C57 C58 = CAP_SMD: Capacitor; Part: CC0603JRNPO9BN300; Alternative Part: *; Value: 30pF 50V; JLCPCB Part: C113797
C63 = C1206: Capacitor; Part: CC1206KKX7RCBB102; Alternative Part: CL31B102KIFNNNE; Value: 1nF 1000V; JLCPCB Part: C107191
D7 D12 D13 = LED_SMT_0603: as D1 on sheet mcu; Value: *
  D7: Color: Green; JLCPCB Part: C2994781
  D12: Color: Yellow; JLCPCB Part: C72038
  D13: Color: Red; JLCPCB Part: C2986060
R44 R45 = RES_SMD: Resistor; Part: RC0603JR-075K1L; Alternative Part: *; Value: 5.1k; JLCPCB Part: C14677
R64-R67 = R0402: Resistor; Part: RC0402JR-0710KL; Value: 10K; Alternative Part: *; JLCPCB Part: C60489
R68 = R0402: Resistor; Part: RC0402FR-072K7L; Value: 2.7K; Alternative Part: *; JLCPCB Part: C138017
R69 R70 = R0603: Resistor; Part: RC0603FR-07300RL; Value: 300; JLCPCB Part: C114617
R79 = R1206: Resistor; Part: RC1206FR-071ML; Value: 1M; Alternative Part: *; JLCPCB Part: C108083
U21 = USBLC6-2SC6: 17V Clamp 5A (8/20Âµs) Ipp Tvs Diode Surface Mount SOT-23-6; MF: STMicroelectronics; Value: *; Check_prices: https://www.snapeda.com/parts/USBLC6-2SC6/STMicroelectronics/view-part/?ref=eda; MP: USBLC6-2SC6; Purchase-URL: https://pricing.snapeda.com/search/part/USBLC6-2SC6/?ref=eda; Price: None; Availability: In Stock; Package: SOT-23-6 STMicroelectronics; SnapEDA_Link: https://www.snapeda.com/parts/USBLC6-2SC6/STMicroelectronics/view-part/?ref=snap; Part: USBLC6-2SC6; Alternative Part: *; JLCPCB Part: C2827654
U23 = FE1.1S-BQFN24B: USB 2.0 HIGH SPEED 4-PORT HUB CONTROLLER; Manufacturer_Name: Terminus Technology; Datasheet Link: https://datasheet.lcsc.com/lcsc/2306141021_Terminus-Tech-FE1-1S-BQFN24B_C6776948.pdf; Height: 0.8mm; Part: FE1.1S-BQFN24B; Alternative Part: *; JLCPCB Part: C6776948
X3 = MOLEX_216989-0001: USB Connector USB TYPE C UPRIGHT STRAIGHT TAB 14 PIN; Part: KUSBX-SL-CS1N14-B; JLCPCB Part: C2894906
Y4 = X503212MSB2GI: as Y5 on sheet eth; Manufacturer_Part_Number: X503212MSB2GI; Part: X503212MSB2GI; Mouser Price/Stock: *; Alternative Part: *; Arrow Price/Stock: *; Datasheet Link: https://datasheet.lcsc.com/szlcsc/Yangxing-Tech-X503212MSB2GI_C112573.pdf; JLCPCB Part: C112573

## Sheet rlink_eth.schdoc
size 209 x 297 mm; Scale: 1:1; DocumentType: Схема электрическая принципиальная; FirstReferrence: АБВГ.123456.001; PageSetup: Record=PageOptions|CenterHorizontal=False|CenterVertical=False|PrintScale=0.95|XCorrection=0.00|YCorrection=0.00|PrintKind=1|BorderSize=5000000|LeftOffset=0|BottomOffset=0|Orientation=1|PaperLength=1000|PaperWidth=1000|Scale=100|PaperSource=15|PrintQuality=600|MediaType=1|DitherType=10|PaperKind=A4|PrintScaleMode=1
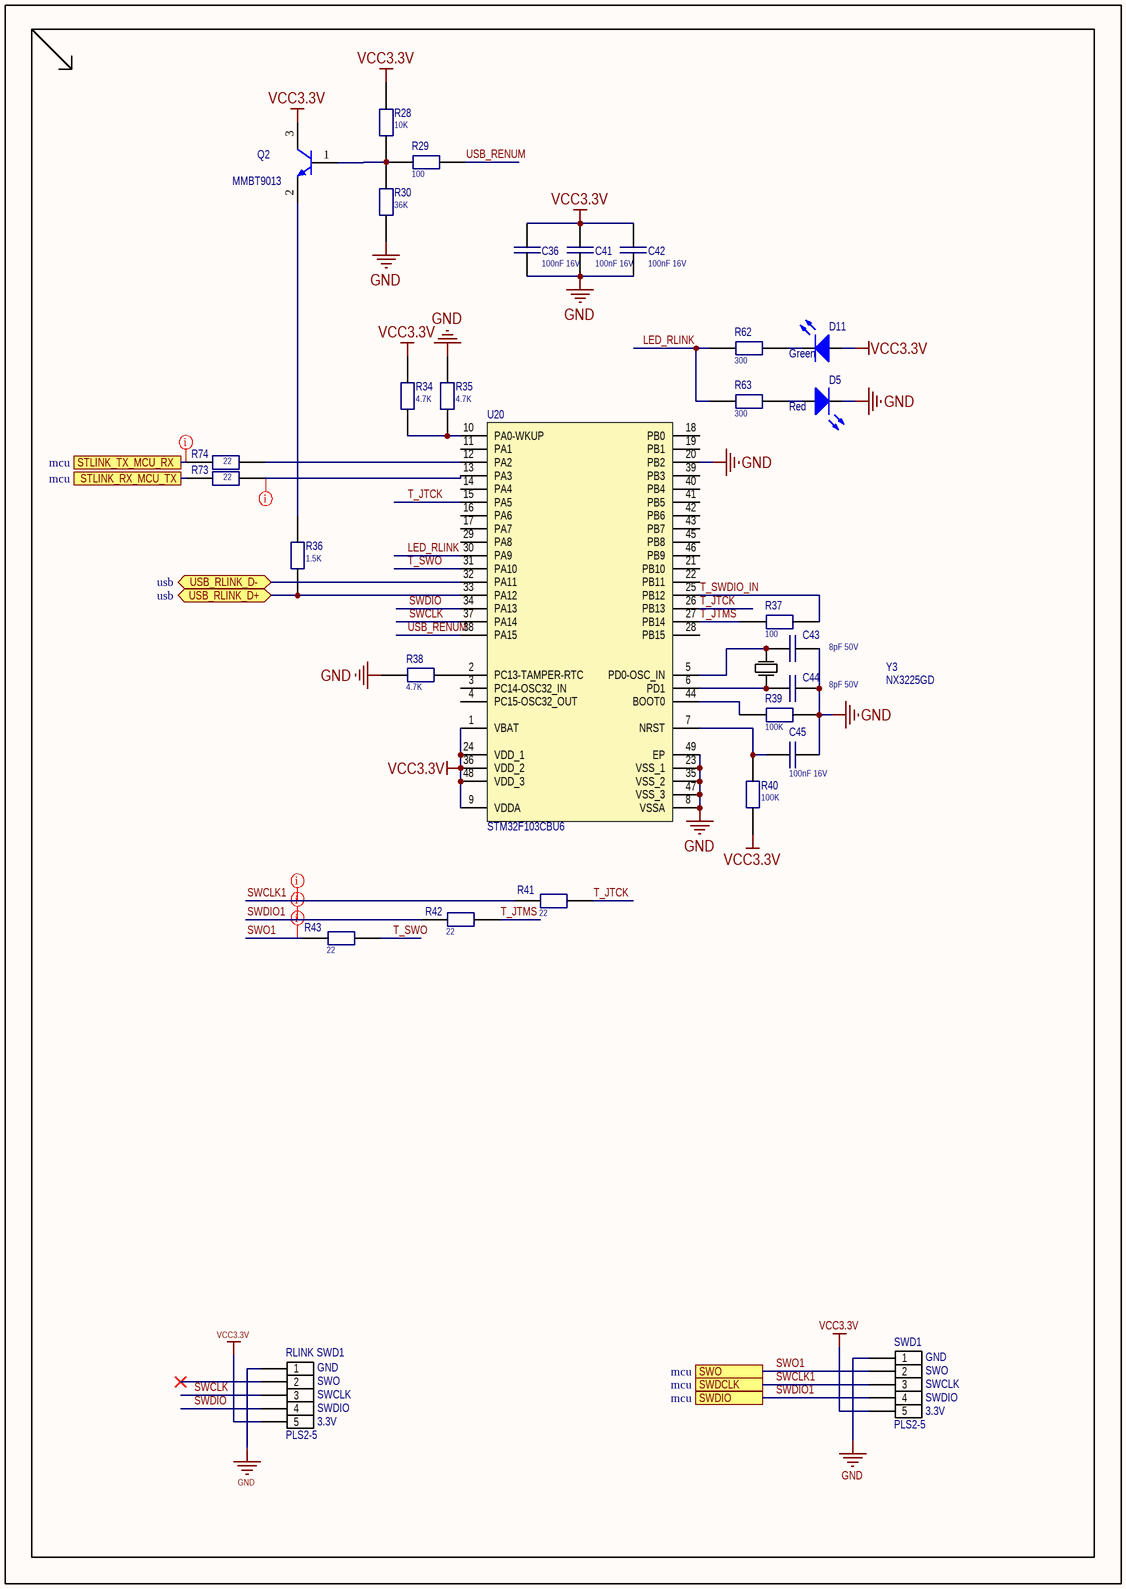
[diagram p9: rlink_eth.schdoc]

### Parts
C36  100nF 16V  [C_0402]
C41  100nF 16V  [C_0402]
C42  100nF 16V  [C_0402]
C43  8pF 50V  [C_0402]
C44  8pF 50V  [C_0402]
C45  100nF 16V  [C_0402]
D5  Red  [LED_0603]
D11  Green  [LED_0603]
Q2  MMBT9013  [SOT23]
R28  10K  [R_0402]
R29  100  [R_0402]
R30  36K  [R_0402]
R34  4.7K  [R_0402]
R35  4.7K  [R_0402]
R36  1.5K  [R_0402]
R37  100  [R_0402]
R38  4.7K  [R_0402]
R39  100K  [R_0402]
R40  100K  [R_0402]
R41  22  [R_0402]
R42  22  [R_0402]
R43  22  [R_0402]
R62  300  [R_0603]
R63  300  [R_0603]
R73  22  [R_0402]
R74  22  [R_0402]
RLINK_SWD1  PLS2-5  [PLS-5-3D]  (net tie, no BOM)
SWD1  PLS2-5  [PLS-5-3D]  (net tie, no BOM)
U20  STM32F103CBU6  [STM-UFQFPN48_M]
Y3  NX3225GD  [NX3225GD]

### Ports
STLINK_RX_MCU_TX (see mcu), STLINK_TX_MCU_RX (see mcu), SWDCLK (see mcu), SWDIO (see mcu), SWO (see mcu), USB_RLINK_D+ (bidir, see usb), USB_RLINK_D- (bidir, see usb)

### Nets
GND: C36.1 C41.1 C42.1 C43.1 C44.1 C45.1 D5.2(K) R30.2 R35.2 R38.2 R39.1 RLINK_SWD1.1 SWD1.1 U20.8(VSSA) U20.20(PB2) U20.23(VSS_1) U20.35(VSS_2) U20.47(VSS_3) U20.49(EP)
VCC3.3V: C36.2 C41.2 C42.2 D11.1(A) Q2.3(C) R28.2 R34.2 R40.2 RLINK_SWD1.5 SWD1.5 U20.1(VBAT) U20.9(VDDA) U20.24(VDD_1) U20.36(VDD_2) U20.48(VDD_3)
LED_RLINK: R62.2 R63.2 U20.30(PA9)
SWCLK: RLINK_SWD1.3 U20.37(PA14)
SWCLK1: R41.2 SWD1.3 ; port SWDCLK
SWDIO: RLINK_SWD1.4 U20.34(PA13)
SWDIO1: R42.2 SWD1.4 ; port SWDIO
SWO1: R43.2 SWD1.2 ; port SWO
T_JTCK: R41.1 U20.15(PA5) U20.26(PB13)
T_JTMS: R37.2 R42.1 U20.27(PB14)
T_SWDIO_IN: R37.1 U20.25(PB12)
T_SWO: R43.1 U20.31(PA10)
USB_RENUM: R29.1 U20.38(PA15)
USB_RLINK_N: U20.32(PA11) ; port USB_RLINK_D-
USB_RLINK_P: R36.1 U20.33(PA12) ; port USB_RLINK_D+
NetC43_2: C43.2 U20.5(PD0-OSC_IN) Y3.2(OSC2)
NetC44_2: C44.2 U20.6(PD1) Y3.1(OSC1)
NetC45_2: C45.2 R40.1 U20.7(NRST)
NetD5_1: D5.1(A) R63.1
NetD11_2: D11.2(K) R62.1
NetQ2_1: Q2.1(B) R28.1 R29.2 R30.1
NetQ2_2: Q2.2(E) R36.2
NetR34_1: R34.1 R35.1 U20.10(PA0-WKUP)
NetR38_1: R38.1 U20.2(PC13-TAMPER-RTC)
NetR39_2: R39.2 U20.44(BOOT0)
NetR73_1: R73.1 U20.13(PA3)
NetR73_2: R73.2 ; port STLINK_RX_MCU_TX
NetR74_1: R74.1 U20.12(PA2)
NetR74_2: R74.2 ; port STLINK_TX_MCU_RX

Not connected (* = marked no-connect by the designer): RLINK_SWD1 2*; U20 3(PC14-OSC32_IN) 4(PC15-OSC32_OUT) 11(PA1) 14(PA4) 16(PA6) 17(PA7) 18(PB0) 19(PB1) 21(PB10) 22(PB11) 28(PB15) 29(PA8) 39(PB3) 40(PB4) 41(PB5) 42(PB6) 43(PB7) 45(PB8) 46(PB9)

### Layout directives
net class UART: NetR73_1, NetR74_2
net class SWD: SWCLK1, SWDIO1, SWO1

### Notes on the sheet
- (in symbol PLS2-5) GND; SWO; SWCLK; SWDIO; 3.3V

### Library data of the parts
C36 C41 C42 C45 = C0402: as C46 on sheet usb; JLCPCB Part: C60474
C43 C44 = C0402: Capacitor; Part: CC0402DRNPO9BN8R0; Alternative Part: *; JLCPCB Part: C327227
D5 D11 = LED_SMT_0603: as D1 on sheet mcu; Value: *
  D5: Color: Red; JLCPCB Part: C2986060
  D11: Color: Green; JLCPCB Part: C2994781
Q2 = NPN: NPN Bipolar Transistor; Code - JEDEC: TO-226-AA; Published: 8-Jun-2000; Revision: July-2002: Re-released for DXP Platform.; Publisher: Altium Limited; Part: MMBT9013; Alternative Part: *; JLCPCB Part: C81408
R28 = R0402: Resistor; Part: RC0402JR-0710KL; Value: 10K; Alternative Part: *; JLCPCB Part: C60489
R29 R37 = R0402: Resistor; Part: RC0402JR-07100RL; Value: 100; Alternative Part: *; JLCPCB Part: C106233
R30 = R0402: Resistor; Part: RC0402JR-0736KL; Value: 36K; Alternative Part: *; JLCPCB Part: C137879
R34 R35 R38 = R0402: Resistor; Part: RC0402JR-074K7L; Value: 4.7K; Alternative Part: *; JLCPCB Part: C105870
R36 = R0402: Resistor; Part: RC0402JR-071K5L; Value: 1.5K; Alternative Part: *; JLCPCB Part: C114451
R39 R40 = R0402: Resistor; Part: RC0402JR-07100KL; Value: 100K; Alternative Part: *; JLCPCB Part: C106234
R41-R43 R73 R74 = R0402: Resistor; Part: RC0402JR-0722RL; Value: 22; Alternative Part: *; JLCPCB Part: C93929
R62 R63 = R0603: Resistor; Part: RC0603FR-07300RL; Value: 300; JLCPCB Part: C114617
RLINK_SWD1 SWD1 = PLS2-5: Header, 5-Pin; Part: DS1021-1x5SF11-B; LatestRevisionDate: 17-Jul-2002; LatestRevisionNote: Re-released for DXP Platform.; Publisher: Altium Limited; JLCPCB Part: *
U20 = STM32F103CBU6: STM32 ARM-based 32-bit MCU Performance Line with 128 kB Flash, 20 kB Internal RAM, -40 to +85°C Temperature, 48-Pin VFQFPN, Tray; DatasheetVersion: rev13.0, Apr-2011; PackageVersion: 2011; PackageReference: VFQFPN48; PackageDescription: 48-Pin Quad Flat No-Lead, 7 x 7 x 0.9 mm Body, 0.5 mm Pitch, Exposed Pad; ComponentLink1Description: Manufacturer URL; ComponentLink1URL: http://www.st.com/; ComponentLink2Description: STM32F103 Datasheet; ComponentLink2URL: http://www.st.com/internet/com/TECHNICAL_RESOURCES/TECHNICAL_LITERATURE/DATASHEET/CD00161566.pdf; ComponentLink3Description: STM32 Family Web Page; ComponentLink3URL: www.st.com/stm32; Part: STM32F103CBU6; Alternative Part: *; JLCPCB Part: C55506
Y3 = NX3225GD: as Y1 on sheet mcu; Alternatve Part: *; JLCPCB Part: C889706

## Nets that join several sheets
GND: mcu (35 pins), connections (14 pins), interfaces (14 pins), dcdc (6 pins), qspi_flash (C40.1 U19.4 U19.9), eeprom (6 pins), eth (17 pins), usb (16 pins), rlink_eth (19 pins)
SHIELD: eth (X4.13 X4.14), usb (6 pins)
VCC3.3V: mcu (30 pins), connections (C30.2 U6.16), interfaces (C21.2 U3.3), dcdc (C38.2 U2.1 U2.4), qspi_flash (C40.2 R31.1 U19.8), eeprom (C56.2 R76.2 R77.2 U24.8), eth (9 pins), usb (6 pins), rlink_eth (15 pins)
VCC5V: mcu (BUZ1.1 R3.2), interfaces (5 pins), dcdc (5 pins)
VCC5VUSB: dcdc (D6.1), usb (5 pins)
VCC24V: connections (D4.2 Q6.2), dcdc (C34.1 U17.1)
ENET_CRS: mcu (U1.43), eth (R50.1)
ENET_MDC: mcu (U1.27), eth (U26.13)
ENET_MDIO: mcu (U1.36), eth (R51.2 U26.12)
ENET_REF_CLK: mcu (U1.35), eth (R52.1)
ENET_RXD0: mcu (U1.44), eth (R58.1)
ENET_RXD1: mcu (U1.45), eth (R57.1)
ENET_TX_EN: mcu (U1.70), eth (R56.1)
ENET_TXD0: mcu (U1.73), eth (R55.1)
ENET_TXD1: mcu (U1.74), eth (R54.1)
NetR18_2: mcu (U1.3), connections (R18.2)
NetR19_2: mcu (U1.13), connections (R19.2)
NetR20_2: mcu (U1.54), connections (R20.2)
NetR21_2: mcu (U1.12), connections (R21.2)
NetR22_2: mcu (U1.53), connections (R22.2)
NetR23_2: mcu (U1.11), connections (R23.2)
NetR24_2: mcu (U1.50), connections (R24.2)
NetR25_2: mcu (U1.49), connections (R25.2)
NetR26_2: mcu (U1.10), connections (R26.2)
NetR27_2: mcu (U1.14), connections (R27.2)
NetR73_2: mcu (U1.113), rlink_eth (R73.2)
NetR74_2: mcu (U1.135), rlink_eth (R74.2)
NetR76_1: mcu (U1.140), eeprom (R76.1 U24.5)
NetR77_1: mcu (U1.139), eeprom (R77.1 U24.6)
NetU1_46: mcu (U1.46), connections (U6.19)
NetU1_47: mcu (U1.47), connections (U6.18)
NetU1_48: mcu (U1.48), connections (U6.17)
NetU1_55: mcu (U1.55), connections (U6.14)
NetU1_77: mcu (U1.77), interfaces (U4.10)
NetU1_78: mcu (U1.78), interfaces (U4.12)
NetU1_80: mcu (U1.80), interfaces (U4.9)
NetU1_81: mcu (U1.81), interfaces (U4.11)
NetU1_93: mcu (U1.93), interfaces (U5.2 U5.3)
NetU1_96: mcu (U1.96), interfaces (U5.4)
NetU1_97: mcu (U1.97), interfaces (U5.1)
NetU1_114: mcu (U1.114), interfaces (U3.4)
NetU1_115: mcu (U1.115), interfaces (U3.1)
NetU1_127: mcu (U1.127), connections (U6.20)
QUADSPI_CLK: mcu (U1.22), qspi_flash (U19.6)
QUADSPI_NCS: mcu (U1.136), qspi_flash (R31.2 U19.1)
QUADSPI_OI0: mcu (U1.20), qspi_flash (U19.5)
QUADSPI_OI1: mcu (U1.21), qspi_flash (U19.2)
QUADSPI_OI2: mcu (U1.19), qspi_flash (U19.3)
QUADSPI_OI3: mcu (U1.18), qspi_flash (U19.7)
SWCLK1: mcu (U1.109), rlink_eth (R41.2 SWD1.3)
SWDIO1: mcu (U1.105), rlink_eth (R42.2 SWD1.4)
SWO1: mcu (U1.133), rlink_eth (R43.2 SWD1.2)
USB_MCU_N: mcu (U1.103), usb (U23.7)
USB_MCU_P: mcu (U1.104), usb (U23.8)
USB_RLINK_N: usb (U23.11), rlink_eth (U20.32)
USB_RLINK_P: usb (U23.12), rlink_eth (R36.1 U20.33)